# EasyEDA Pro project little_squeaky_machine.eprj, schematic Little Squeaky Machine

## Sheets
1 Processing: Board Name: Little_Squeaky_Machine_Hardware; Create Date: 2025-10-26; Page Name: Processing; Project Name: little_squeaky_machine; Schematic Name: Little Squeaky Machine; Update Date: 2026-02-13; Company: Hi Squeaky Things Lab; Drawn: Daniël; Page Size: A3; Reviewed: Daniël; Version: 0.1.0
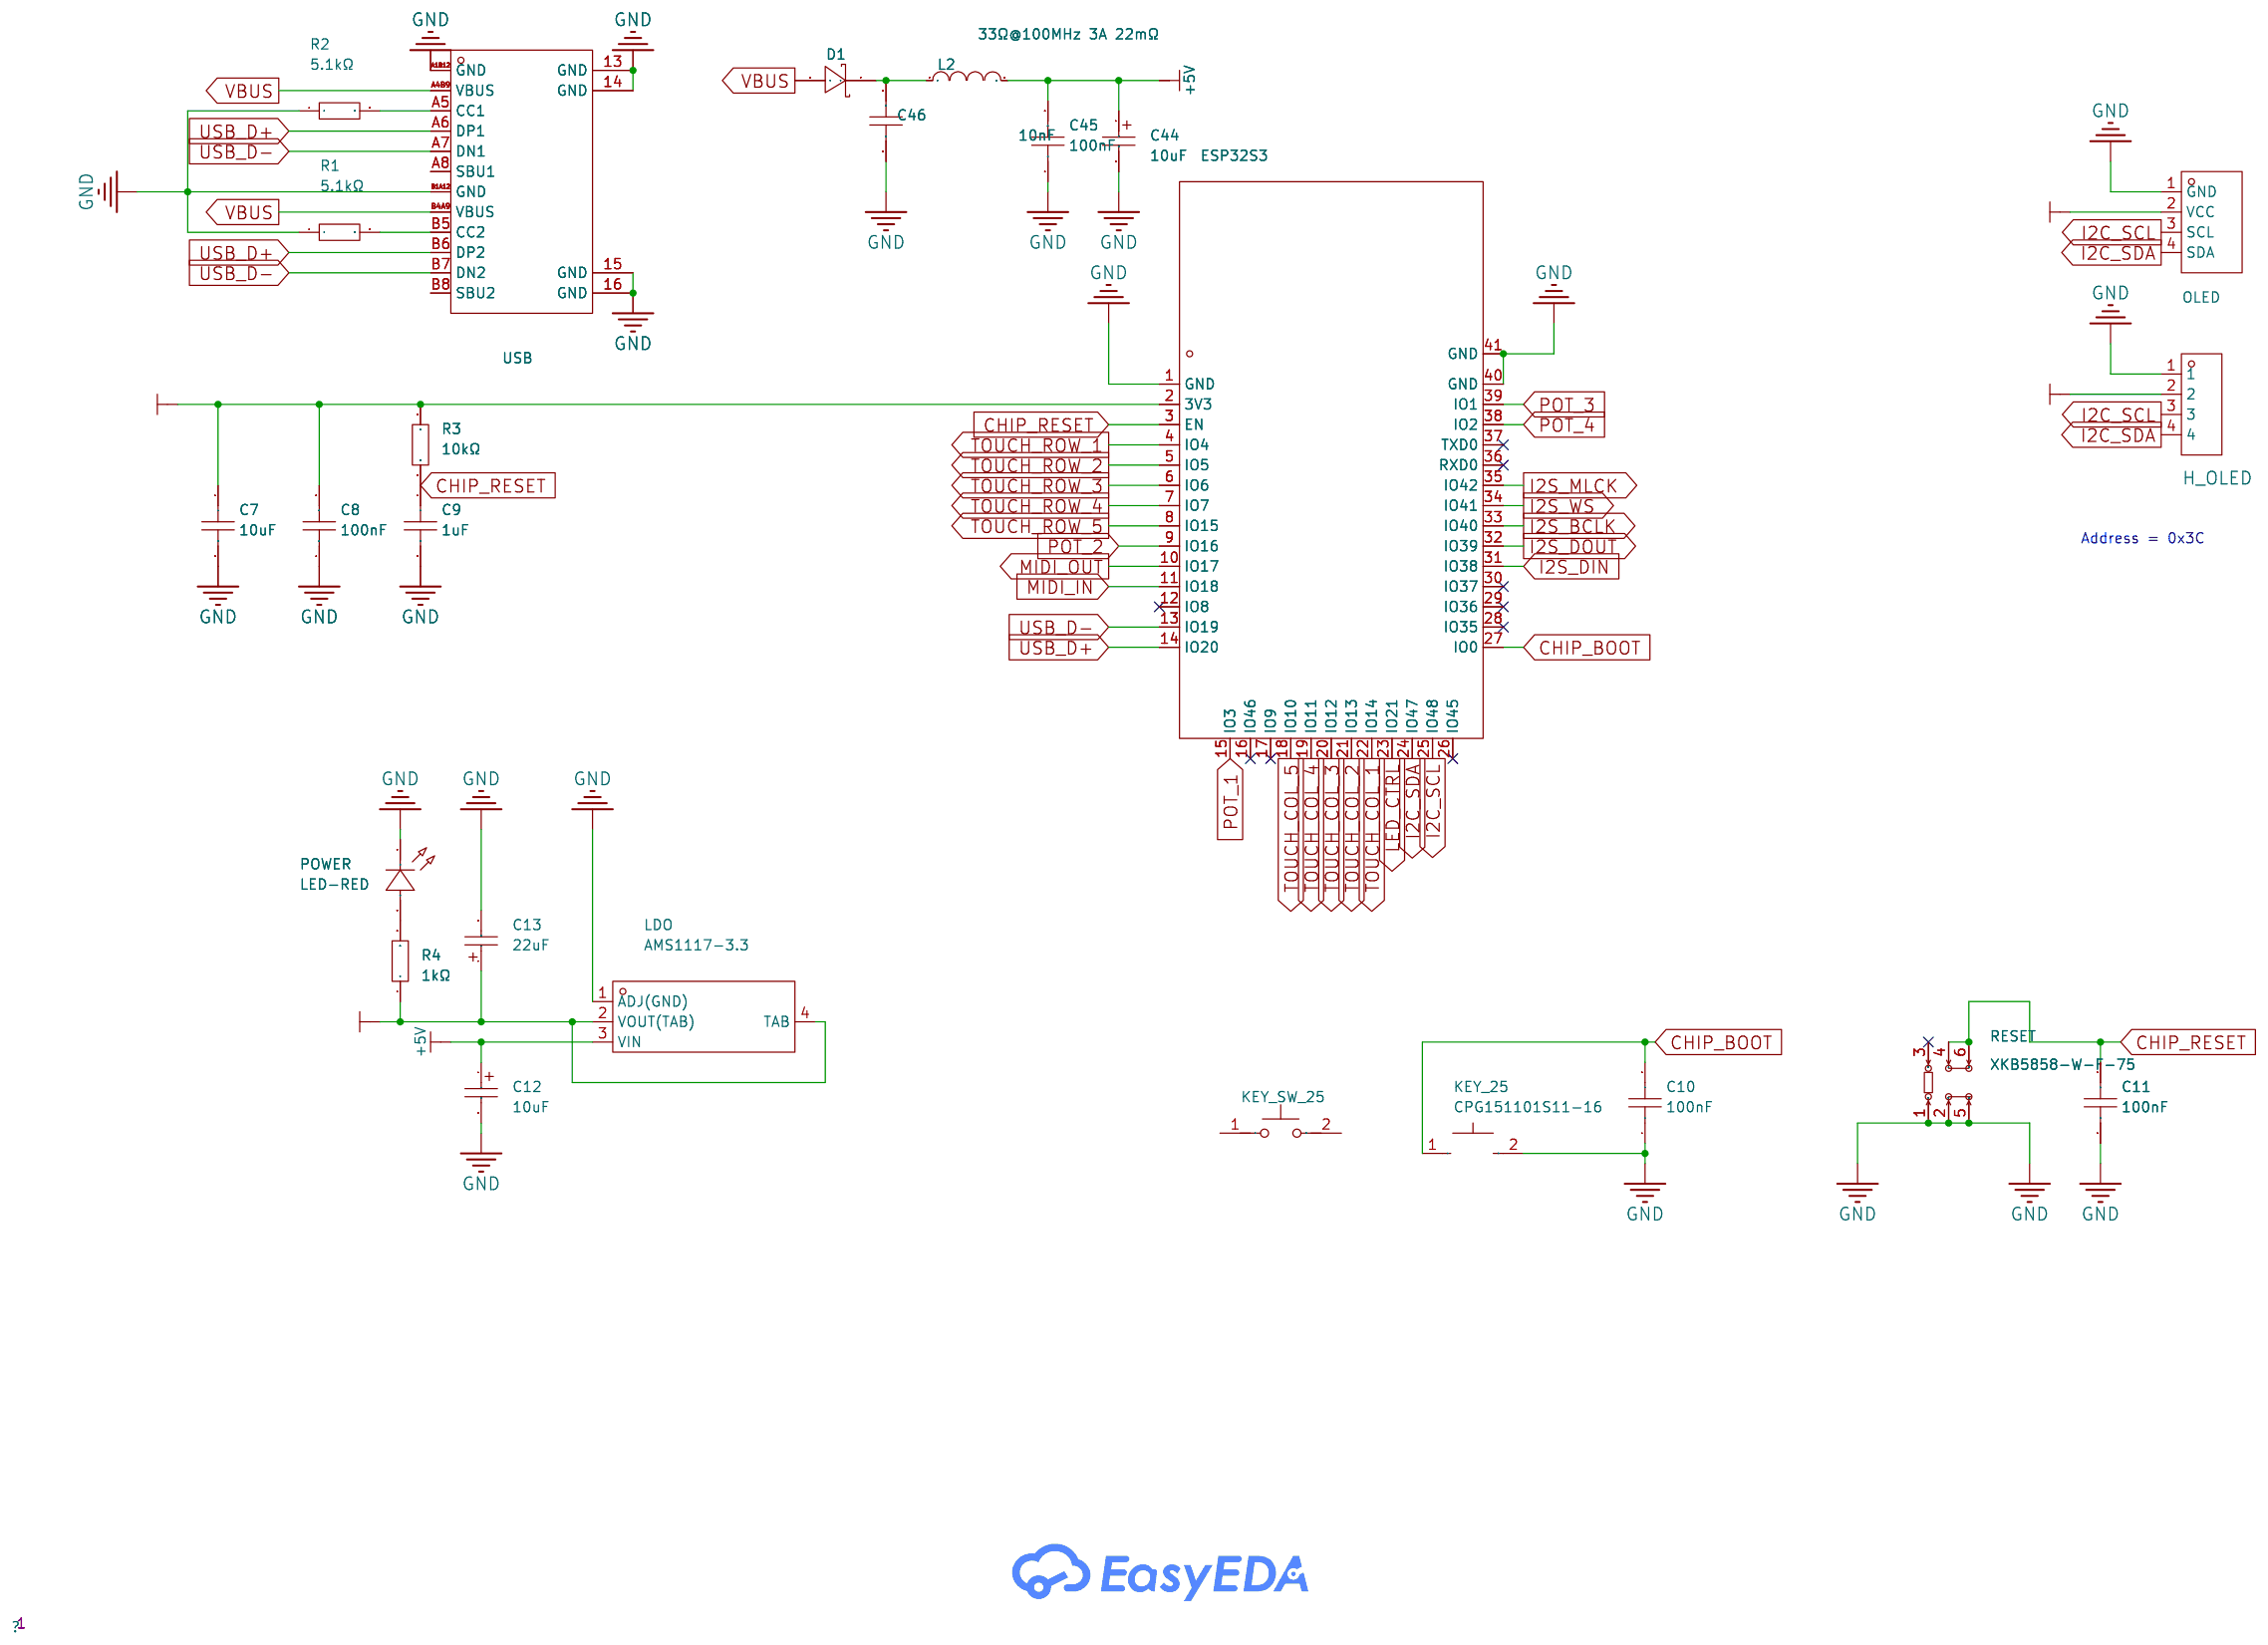
[diagram p0: Processing]
2 Audio Codec: Page Name: Audio Codec; Company: Hi Squeaky Things
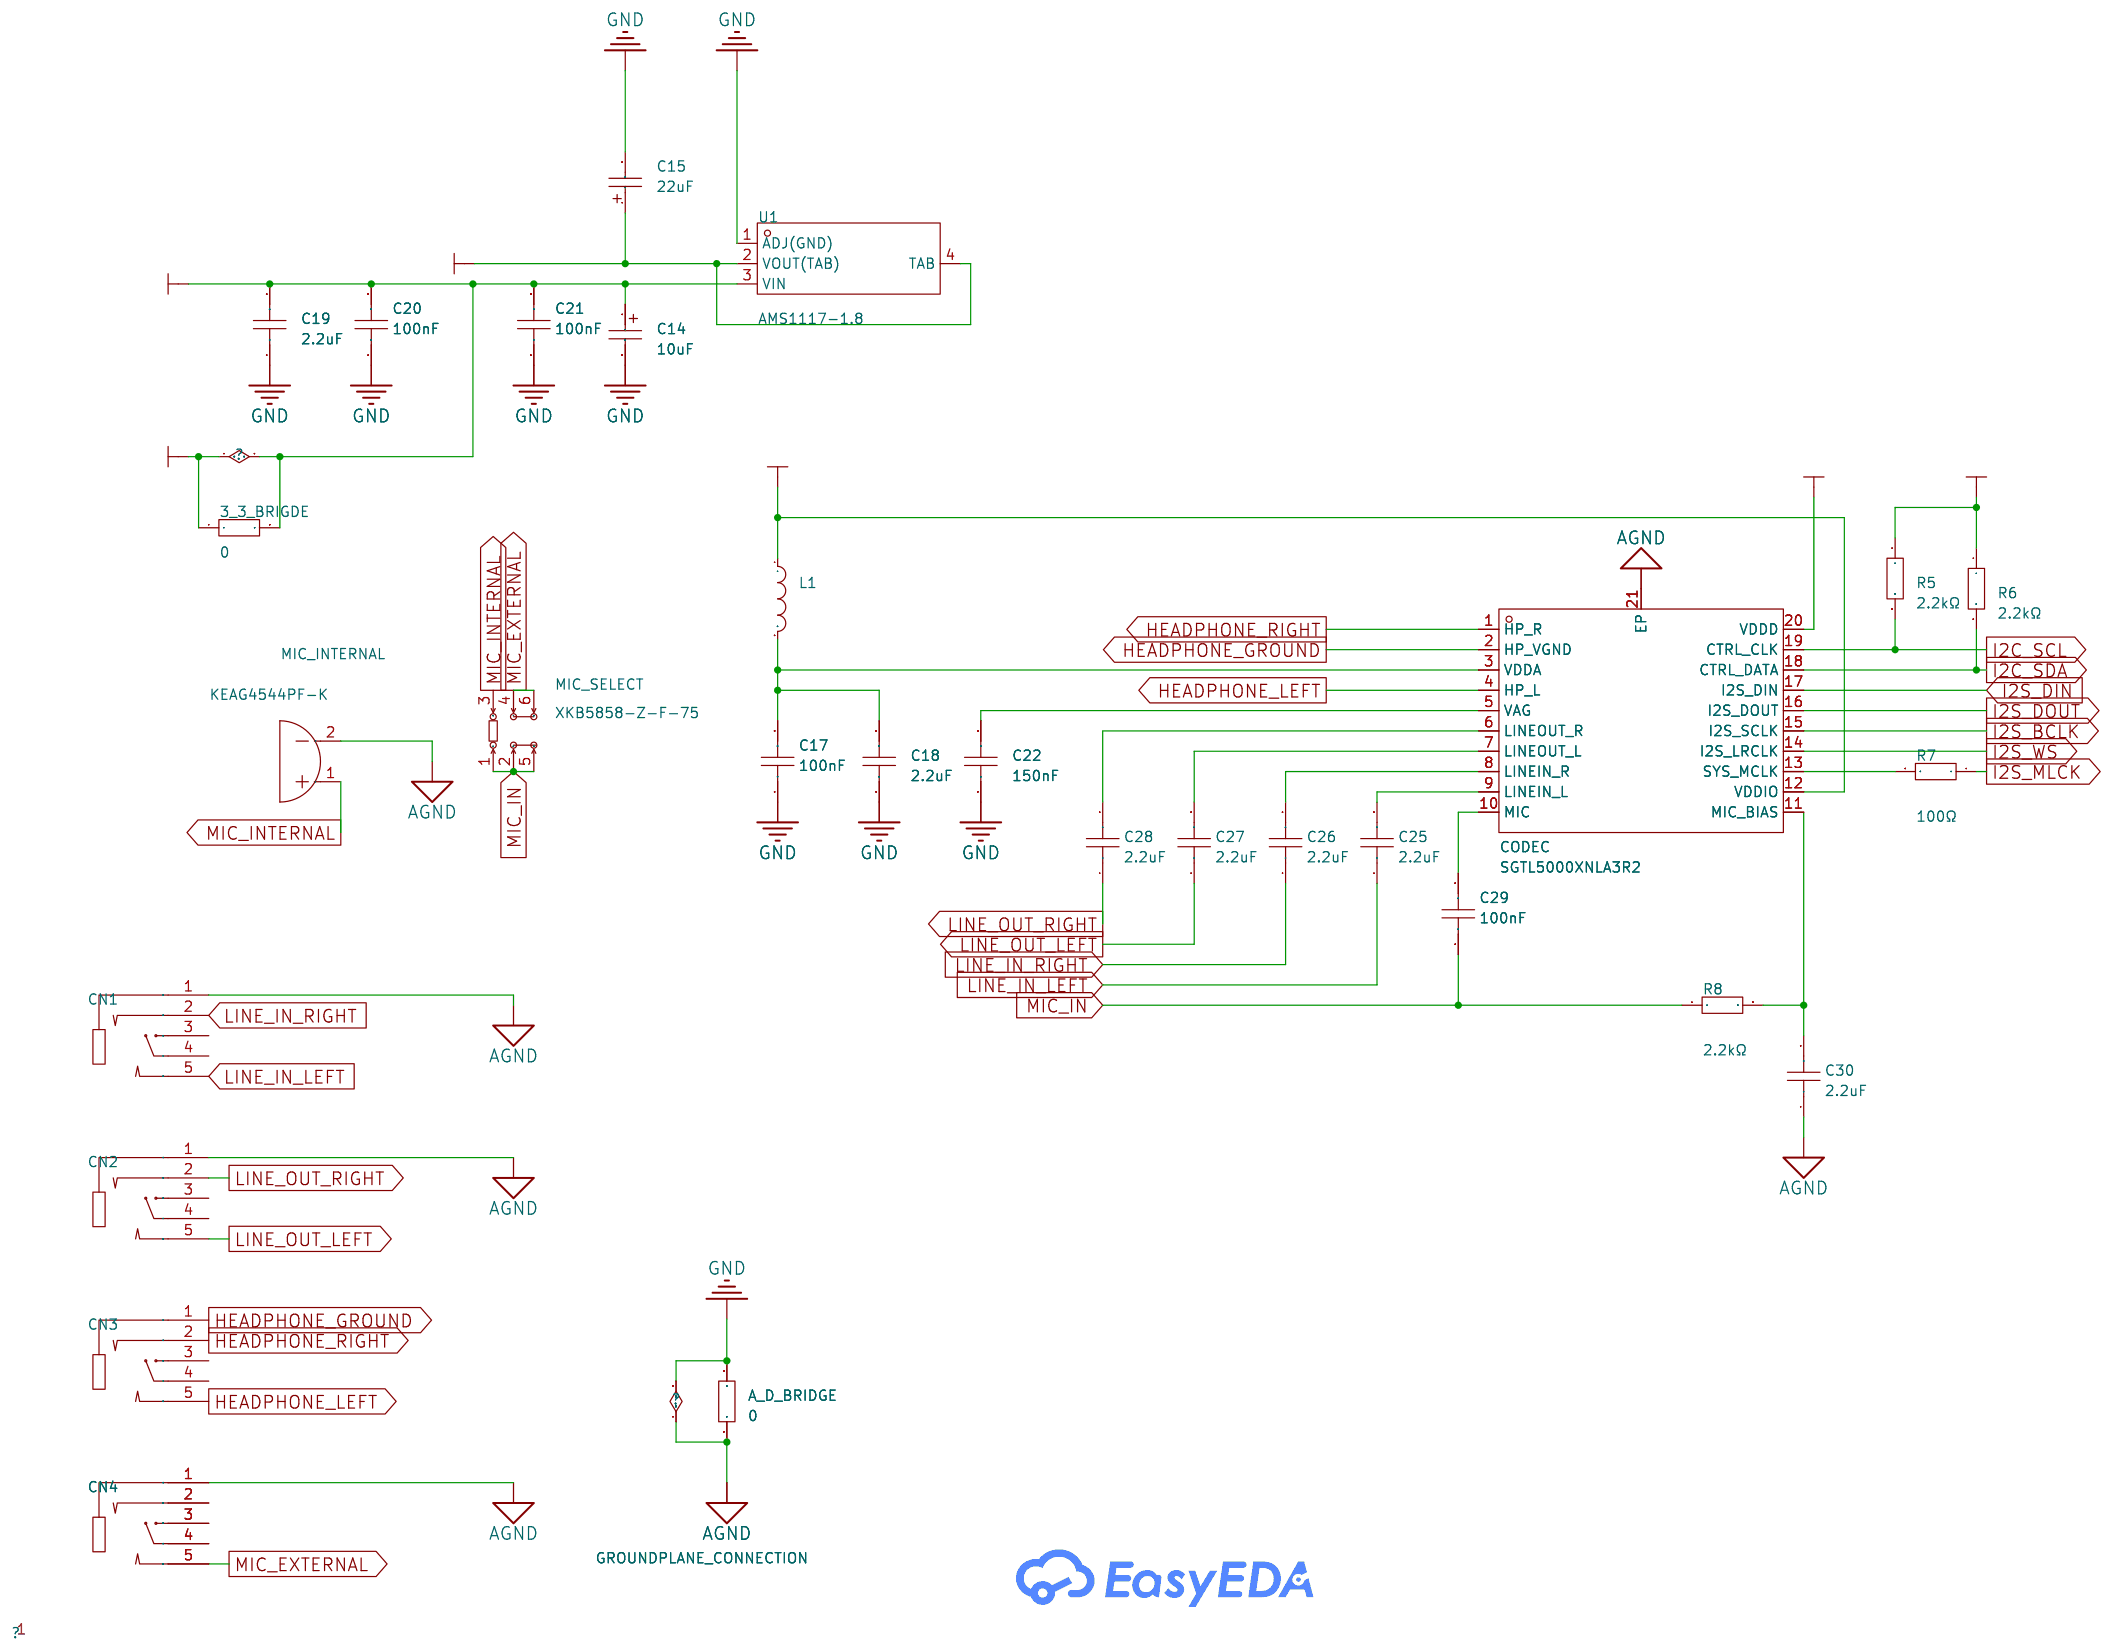
[diagram p1: Audio Codec]
3 Led Controls: Page Name: Led Controls; Company: Hi Squeaky Things; Drawn: Daniel; Page Size: A4
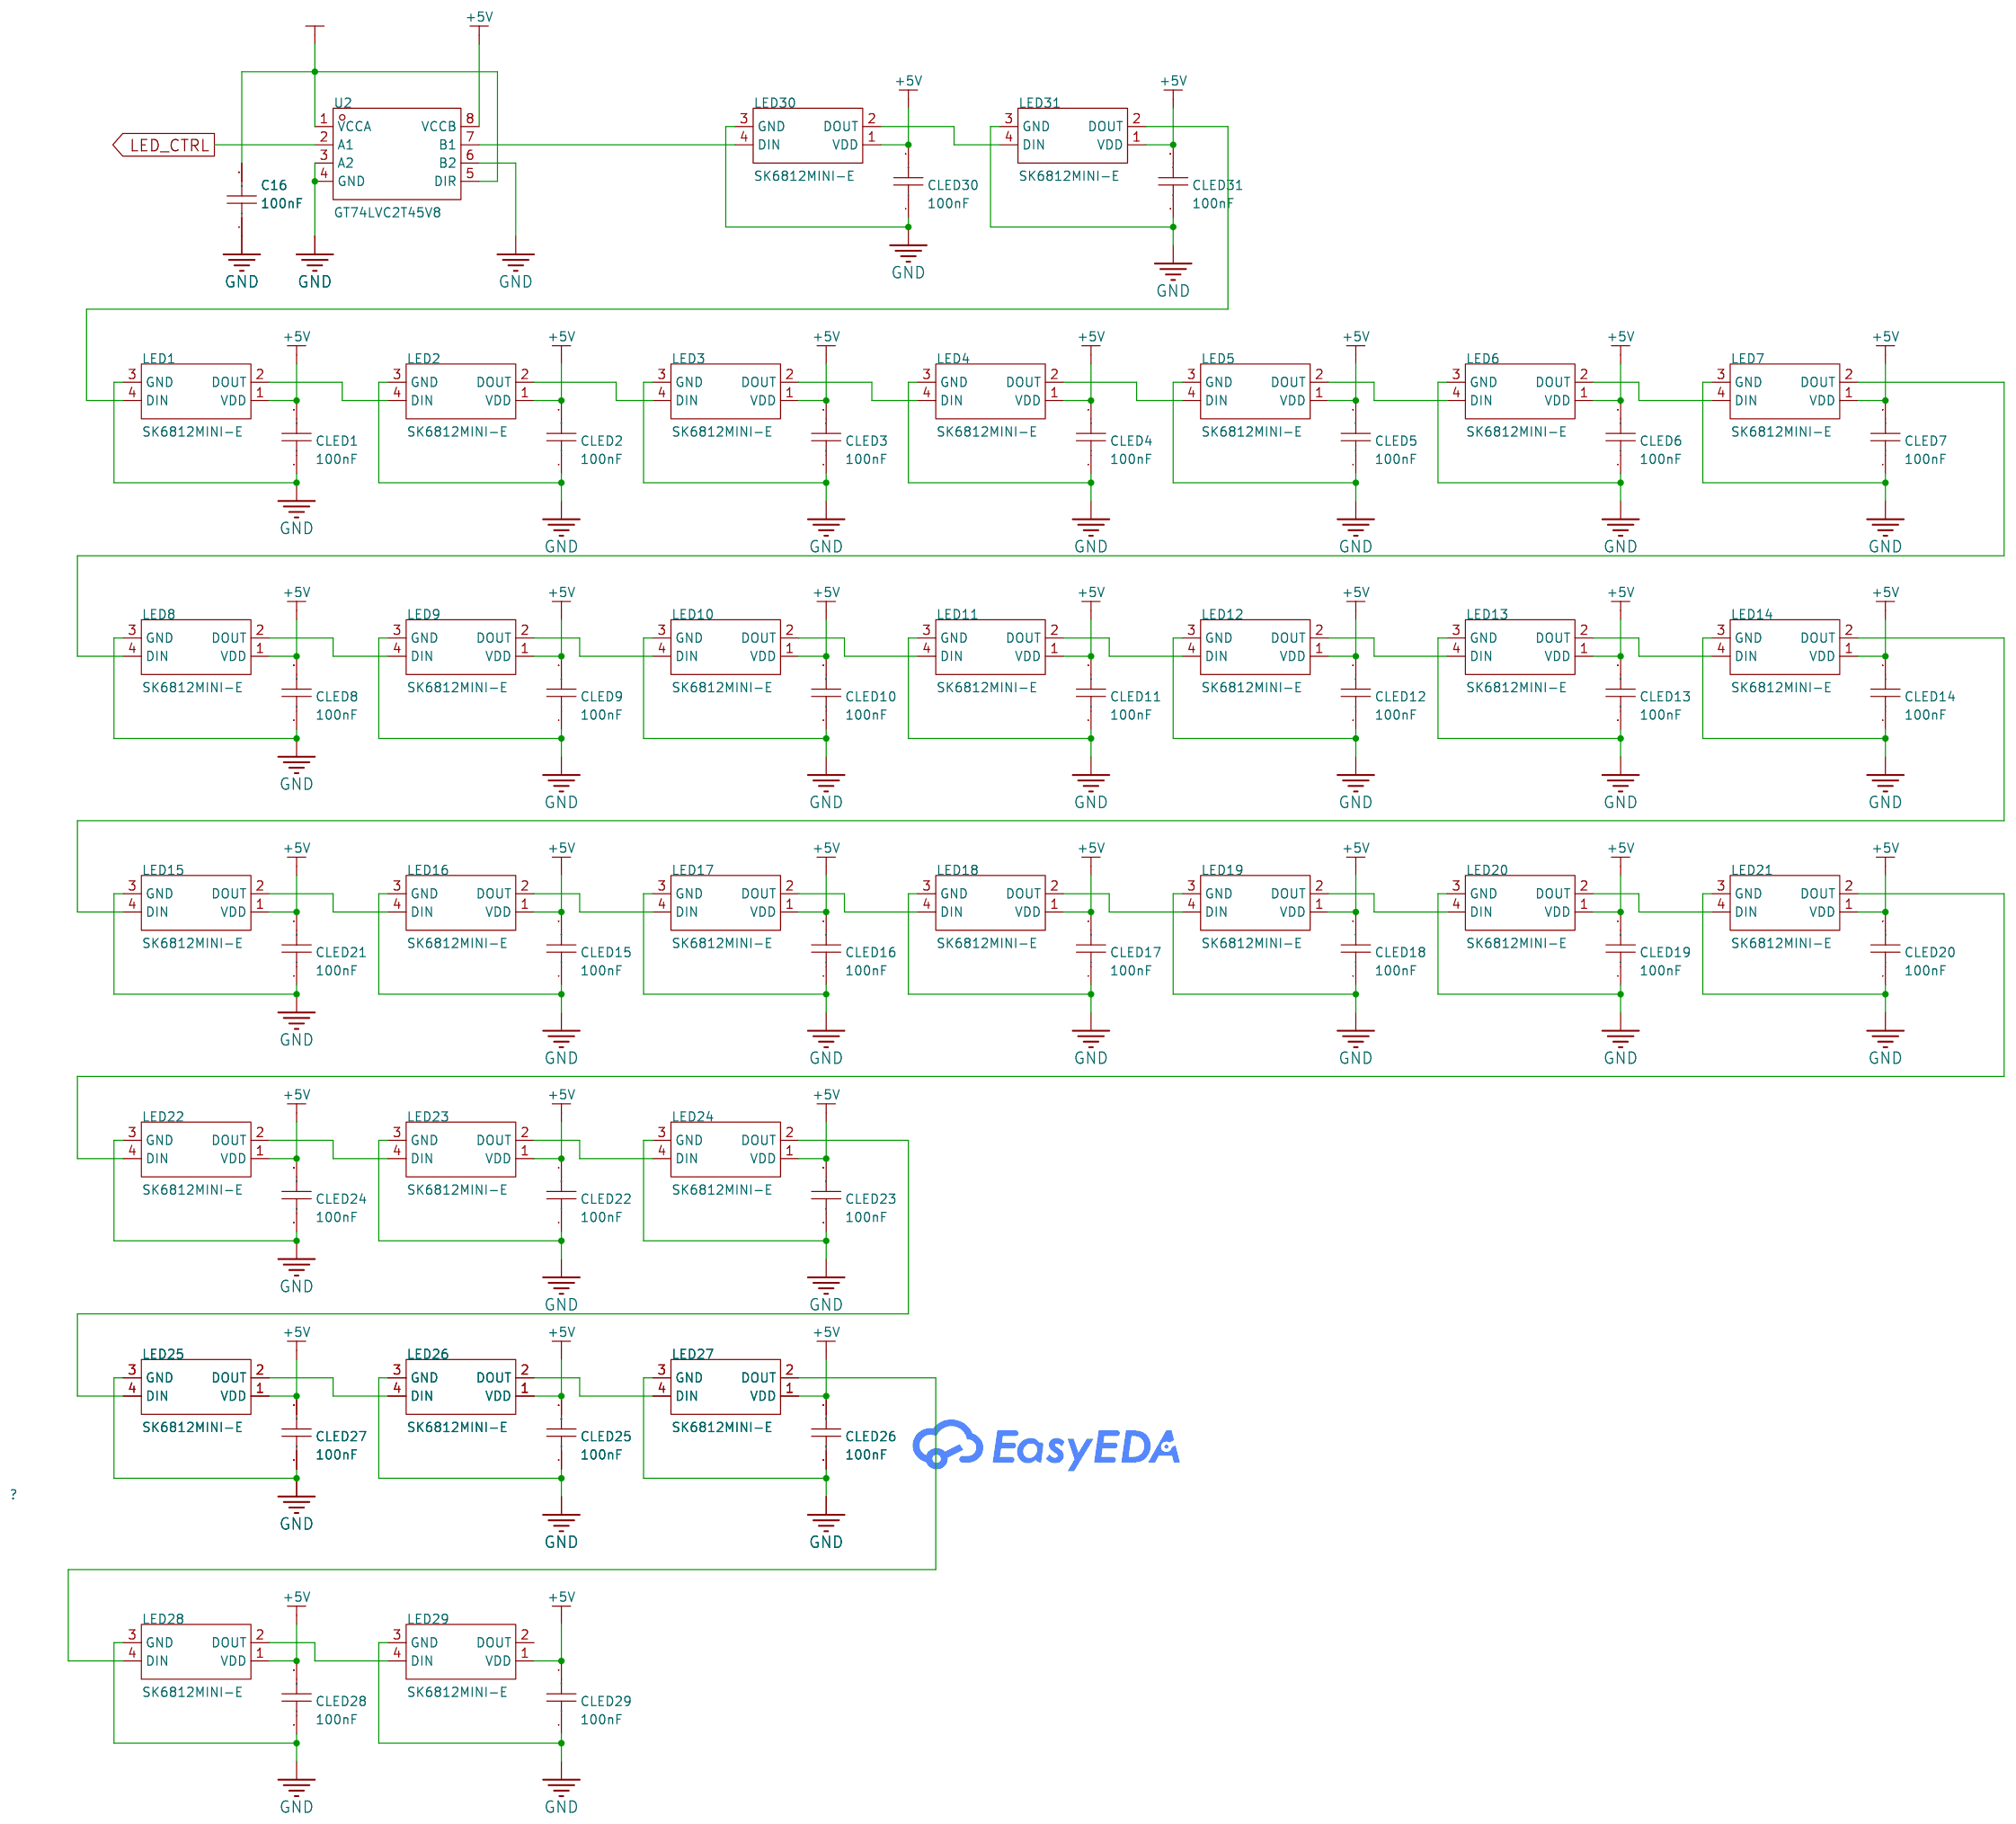
[diagram p2: Led Controls]
4 Key Matrix Controls: Page Name: Key Matrix Controls; Company: Hi Squeaky Things; Page Size: A4
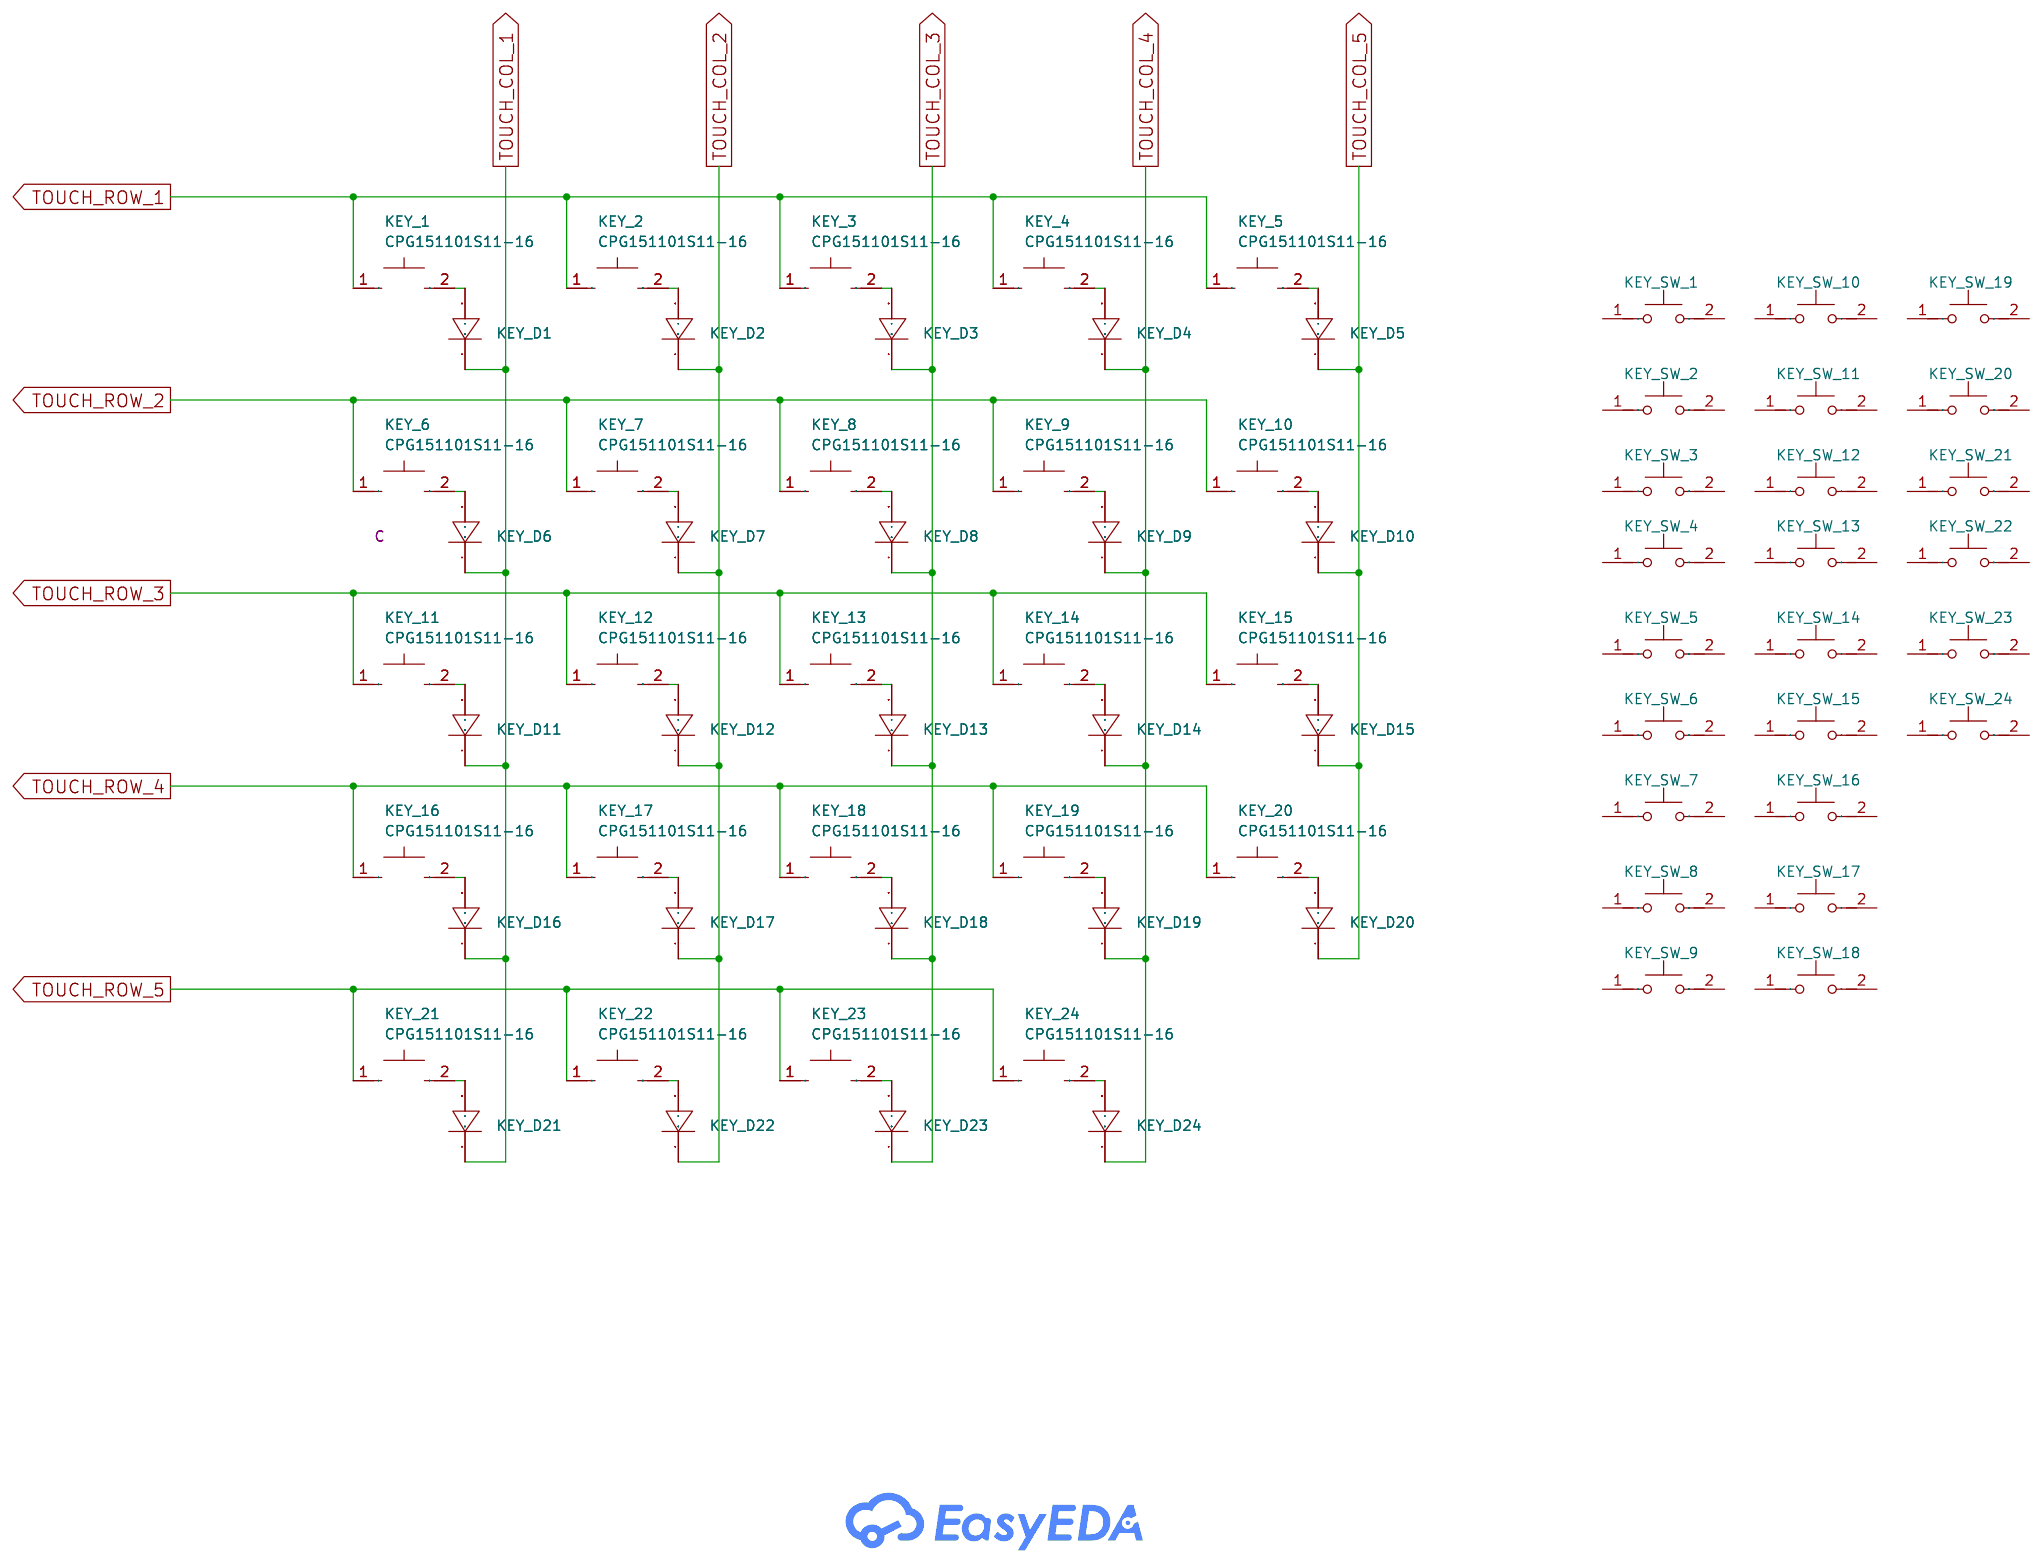
[diagram p3: Key Matrix Controls]
5 Pot and Encoder Controls: Page Name: Pot and Encoder Controls; Company: Hi Squeaky Things; Page Size: A4
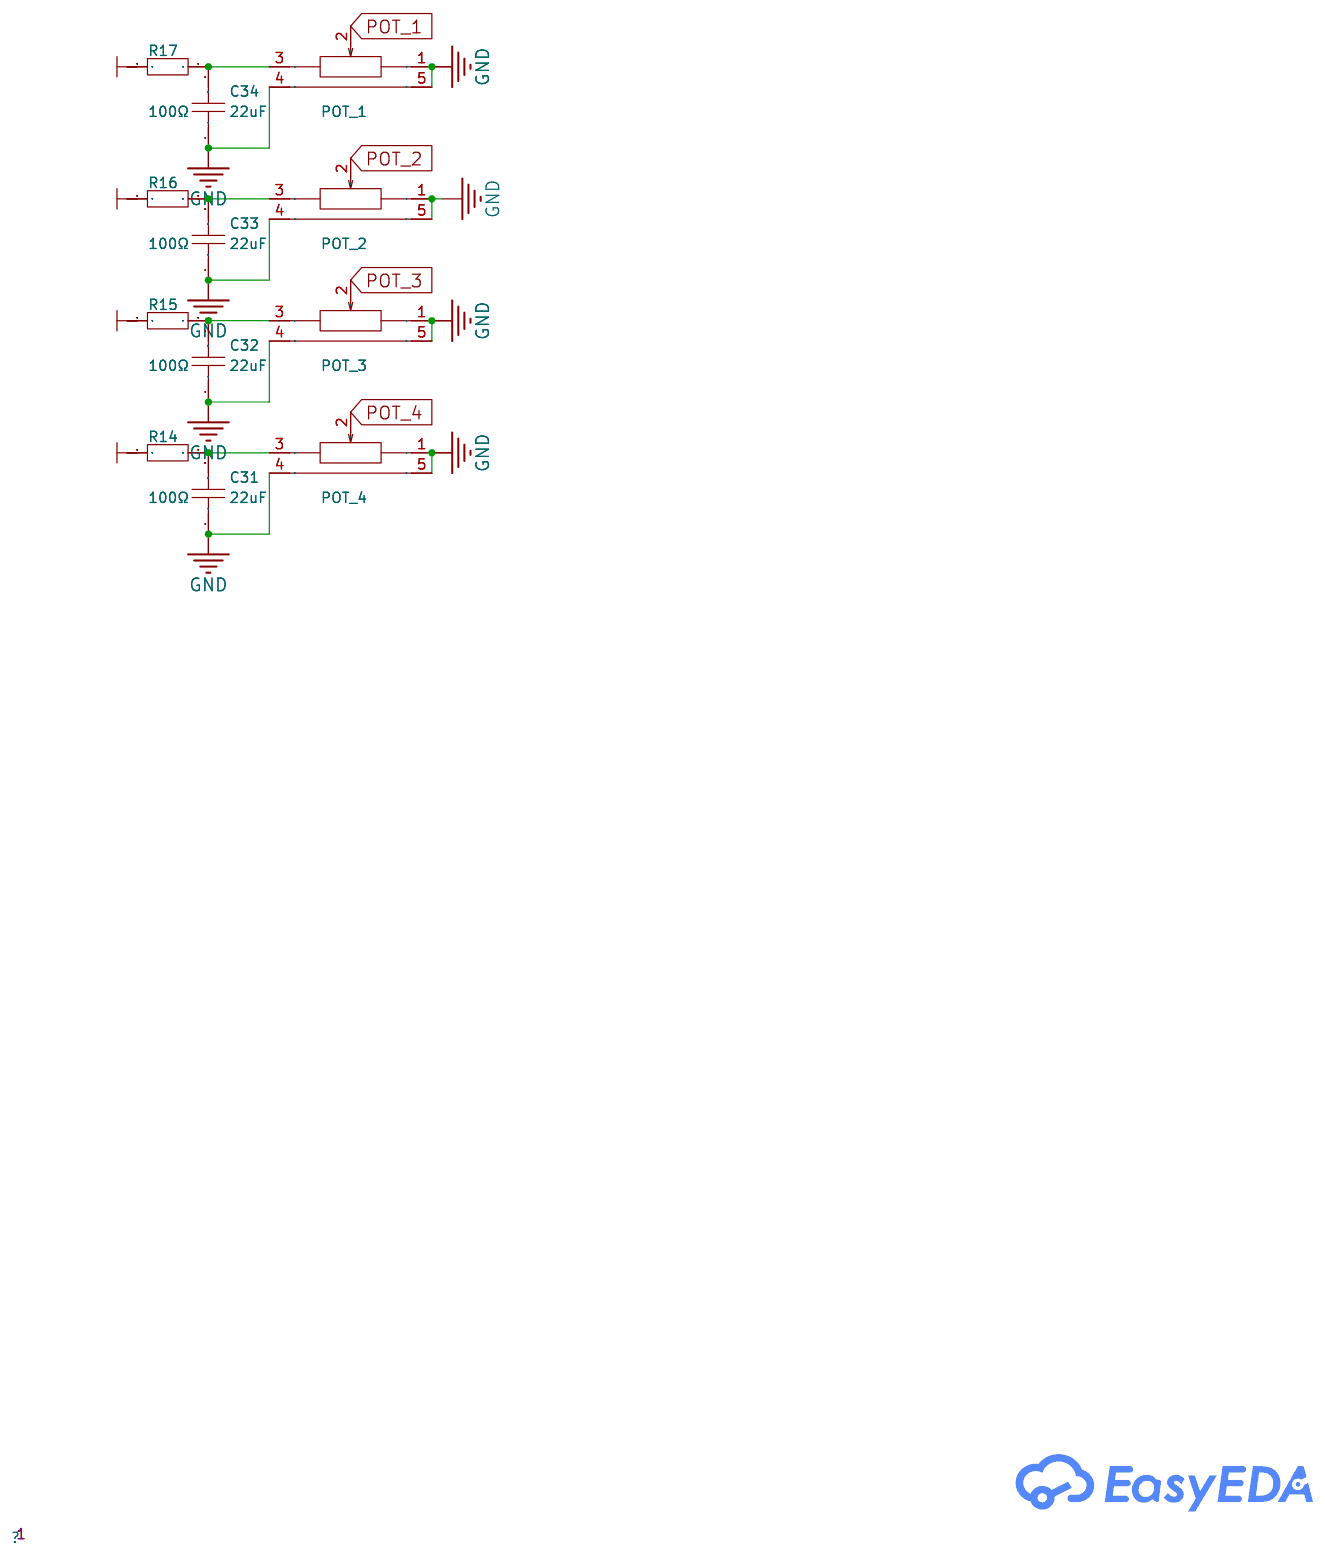
[diagram p4: Pot and Encoder Controls]
6 Midi In/Out: Page Name: Midi In/Out; Company: Hi Squeaky Things; Page Size: A4
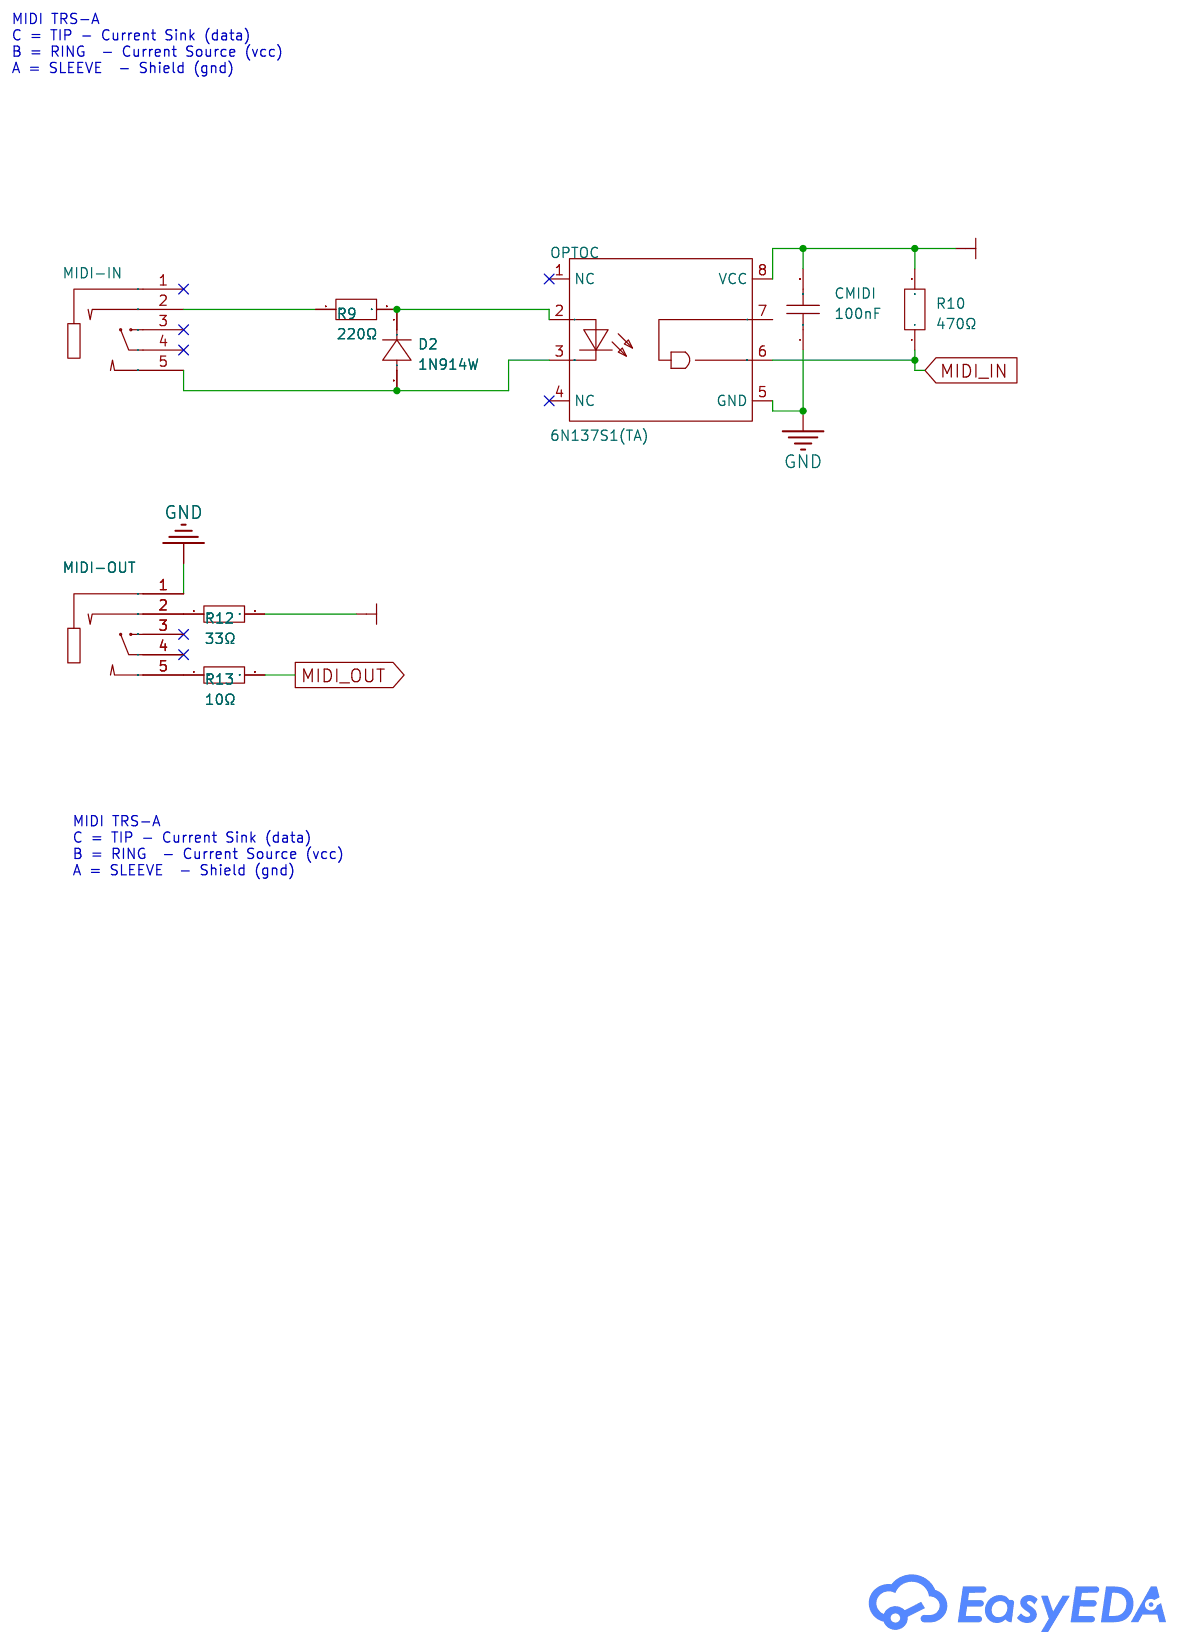
[diagram p5: Midi In/Out]
7 Touch control: Create Date: 2026-02-10; Page Name: Touch control; Company: EasyEDA.com; Page Size: A4; Version: V1.0
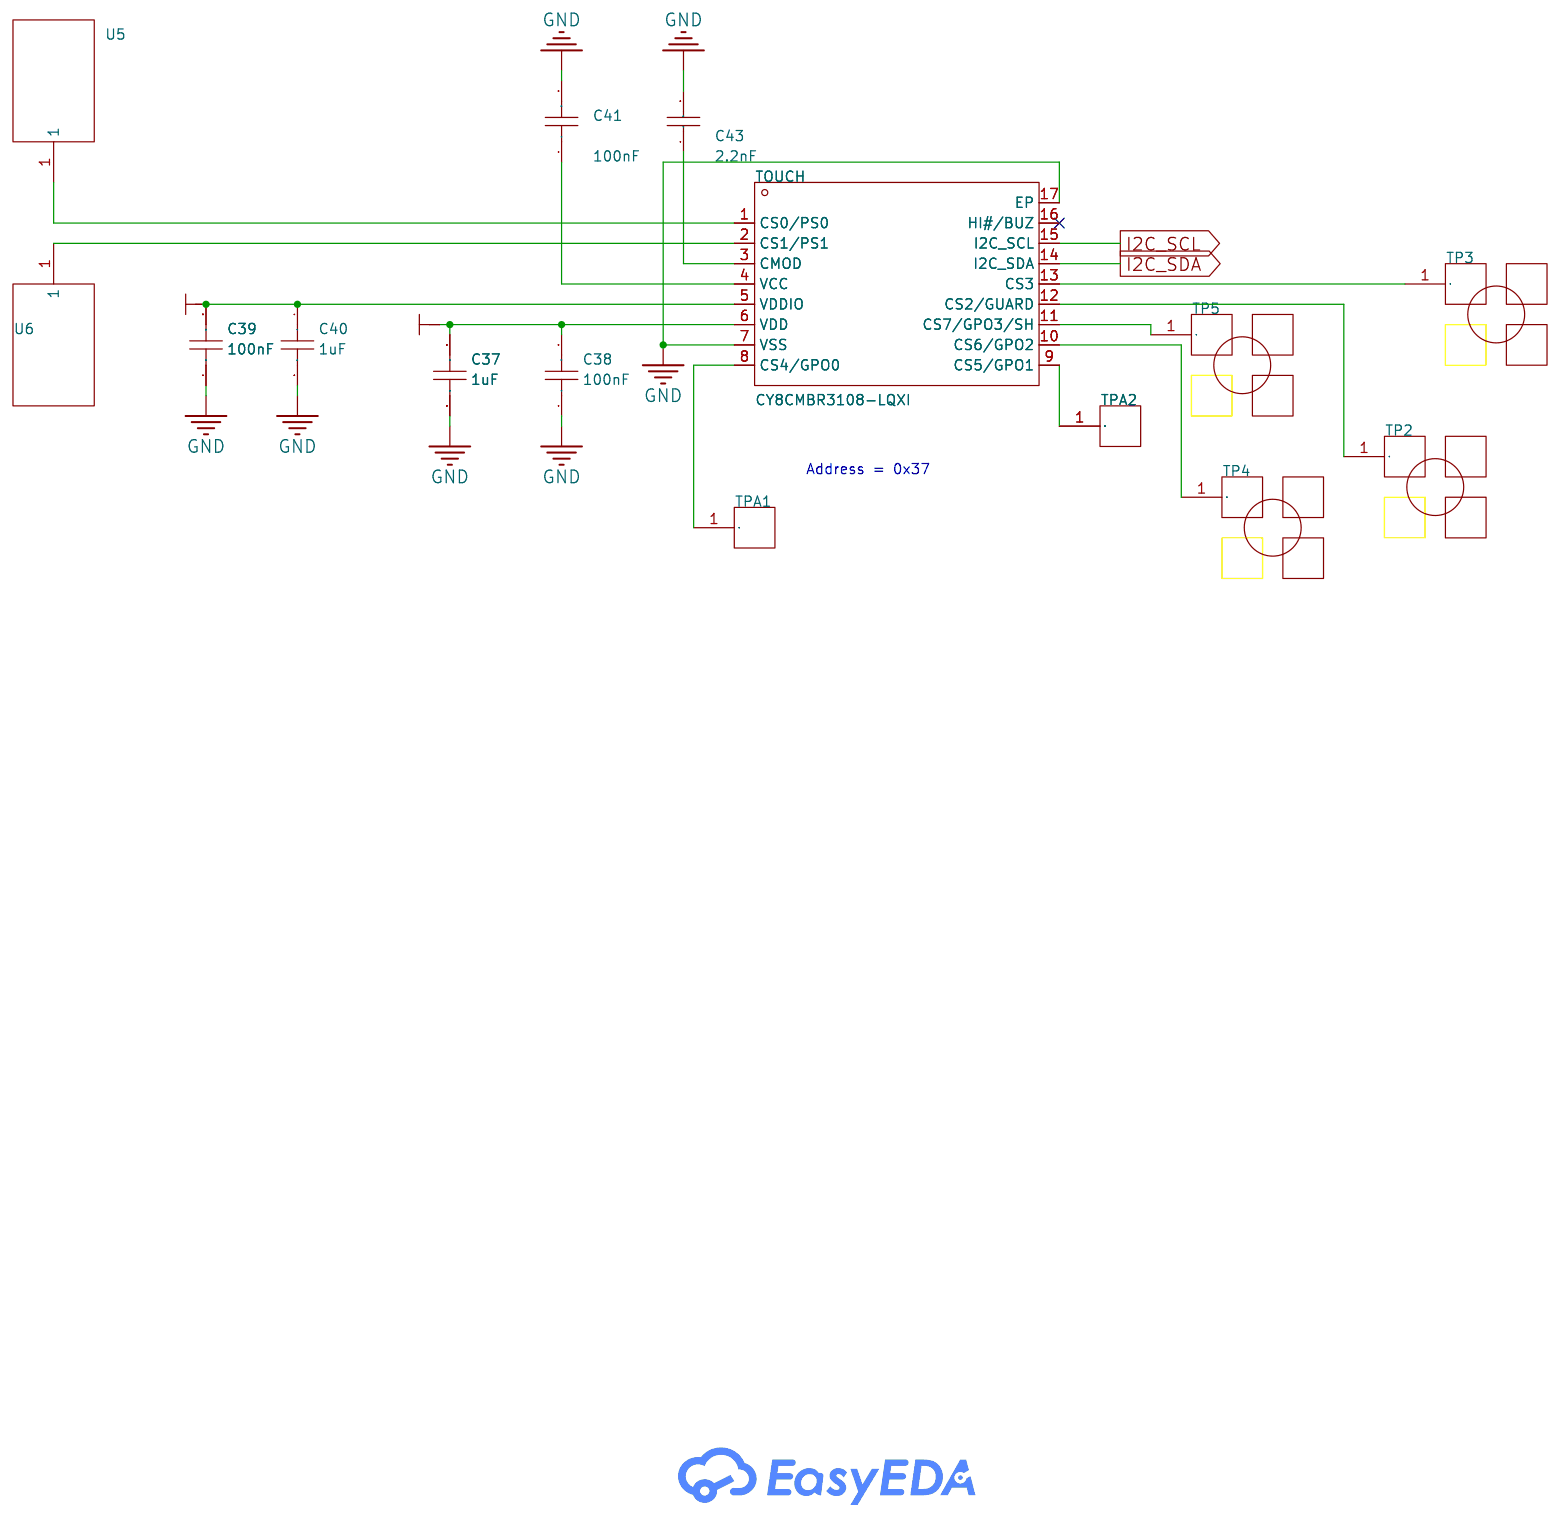
[diagram p6: Touch control]
8 Gyro Control: Create Date: 2026-02-10; Page Name: Gyro Control; Company: EasyEDA.com; Page Size: A4; Version: V1.0
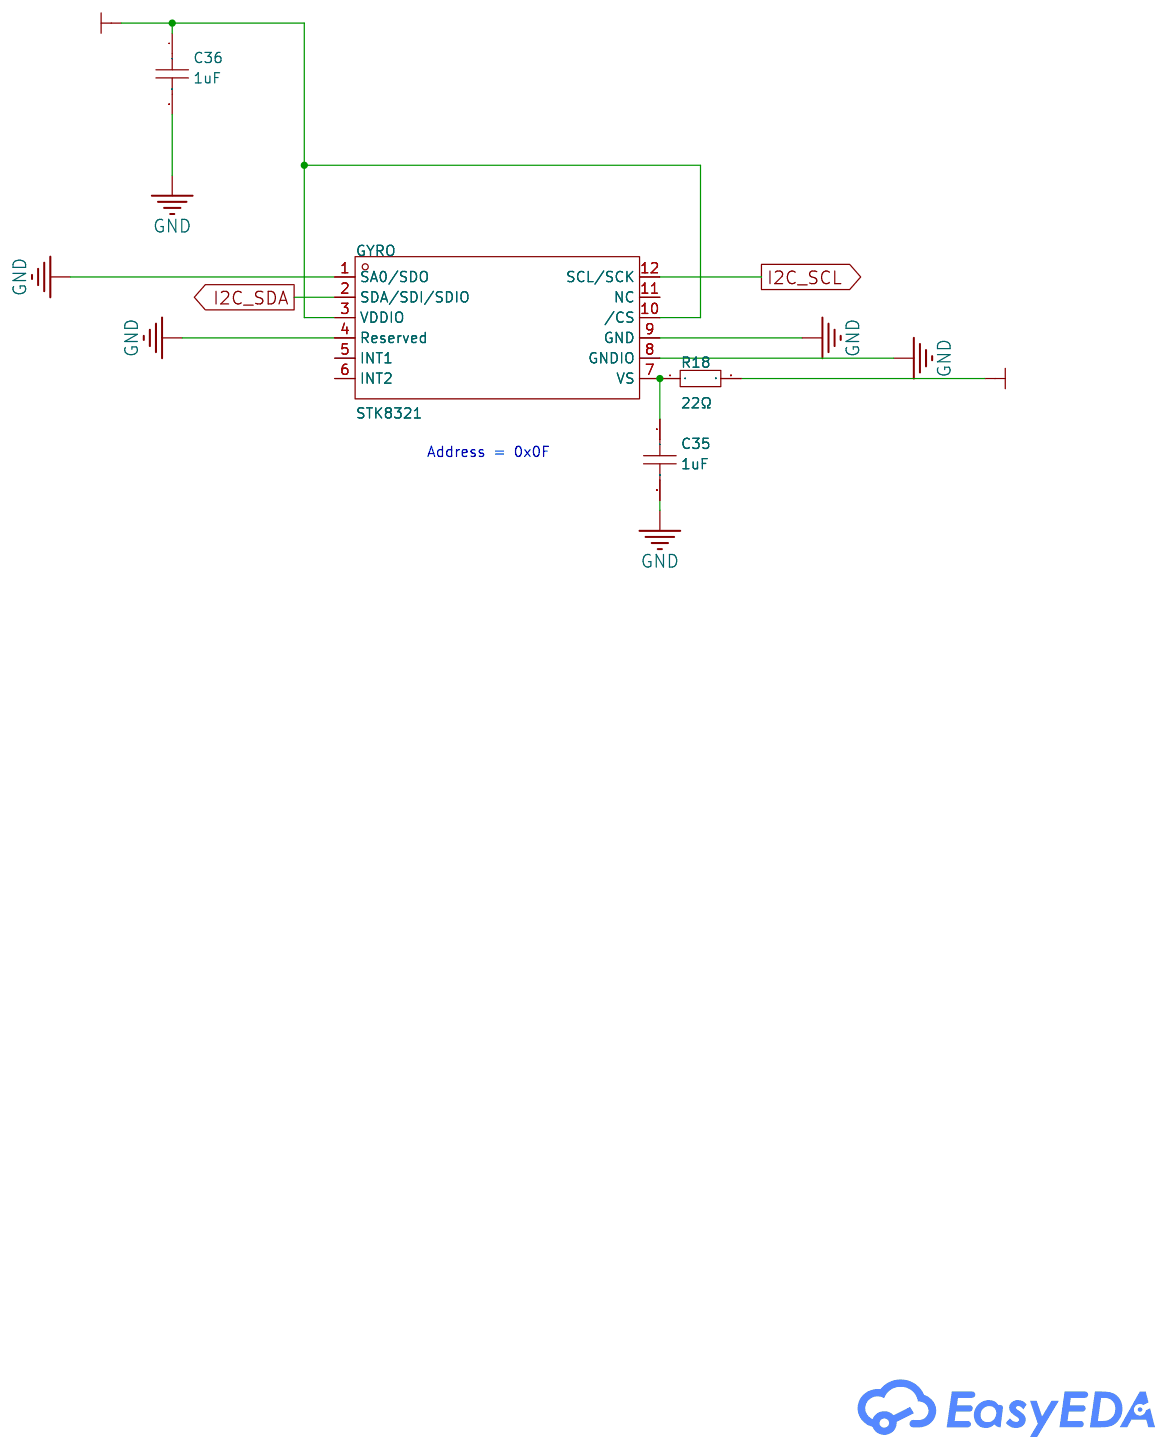
[diagram p7: Gyro Control]

## Parts
sheet Audio Codec
3_3_BRIGDE  0  [R0603]  (no BOM)
A_D_BRIDGE  0  [R0603]  (no BOM)
C14  10uF  [CASE-A_3216]
C15  22uF  [CASE-A_3216]
C17  100nF  [C0402]
C18  2.2uF  [C0402]
C19  2.2uF  [C0402]
C20  100nF  [C0402]
C21  100nF  [C0402]
C22  150nF  [C0402]
C25  2.2uF  [C0402]
C26  2.2uF  [C0402]
C27  2.2uF  [C0402]
C28  2.2uF  [C0402]
C29  100nF  [C0402]
C30  2.2uF  [C0402]
CN1  PJ-3062-HD-B  [AUDIO-TH_PJ-3062-HD-B]
CN2  PJ-3062-HD-B  [AUDIO-TH_PJ-3062-HD-B]
CN3  PJ-3062-HD-B  [AUDIO-TH_PJ-3062-HD-B]
CN4  PJ-3062-HD-B  [AUDIO-TH_PJ-3062-HD-B]
CODEC  SGTL5000XNLA3R2  [QFN-20_L3.0-W3.0-P0.40-BL-EP1.7]
L1  HCB2012KV-601T20  [L0805]
MIC_INTERNAL  KEAG4544PF-K  [MIC-TH_BD9.7-P2.50-D0.8-L-FD]
MIC_SELECT  XKB5858-Z-F-75  [SW-SMD_XKB5858-Z-F-75]
R5  2.2kΩ  [R0603]
R6  2.2kΩ  [R0603]
R7  100Ω  [R0603]
R8  2.2kΩ  [R0603]
U1  AMS1117-1.8  [SOT-223_L6.7-W3.5-P2.30-BR]
sheet Gyro Control
C35  1uF  [C0201]
C36  1uF  [C0201]
GYRO  STK8321  [LGA-12_L2.0-W2.0-P0.50-TR]
R18  22Ω  [R0603]
sheet Key Matrix Controls
KEY_1  CPG151101S11-16  [SMD_KEYBOARD-SW]
KEY_2  CPG151101S11-16  [SMD_KEYBOARD-SW]
KEY_3  CPG151101S11-16  [SMD_KEYBOARD-SW]
KEY_4  CPG151101S11-16  [SMD_KEYBOARD-SW]
KEY_5  CPG151101S11-16  [SMD_KEYBOARD-SW]
KEY_6  CPG151101S11-16  [SMD_KEYBOARD-SW]
KEY_7  CPG151101S11-16  [SMD_KEYBOARD-SW]
KEY_8  CPG151101S11-16  [SMD_KEYBOARD-SW]
KEY_9  CPG151101S11-16  [SMD_KEYBOARD-SW]
KEY_10  CPG151101S11-16  [SMD_KEYBOARD-SW]
KEY_11  CPG151101S11-16  [SMD_KEYBOARD-SW]
KEY_12  CPG151101S11-16  [SMD_KEYBOARD-SW]
KEY_13  CPG151101S11-16  [SMD_KEYBOARD-SW]
KEY_14  CPG151101S11-16  [SMD_KEYBOARD-SW]
KEY_15  CPG151101S11-16  [SMD_KEYBOARD-SW]
KEY_16  CPG151101S11-16  [SMD_KEYBOARD-SW]
KEY_17  CPG151101S11-16  [SMD_KEYBOARD-SW]
KEY_18  CPG151101S11-16  [SMD_KEYBOARD-SW]
KEY_19  CPG151101S11-16  [SMD_KEYBOARD-SW]
KEY_20  CPG151101S11-16  [SMD_KEYBOARD-SW]
KEY_21  CPG151101S11-16  [SMD_KEYBOARD-SW]
KEY_22  CPG151101S11-16  [SMD_KEYBOARD-SW]
KEY_23  CPG151101S11-16  [SMD_KEYBOARD-SW]
KEY_24  CPG151101S11-16  [SMD_KEYBOARD-SW]
KEY_D1  -  [SOD-323_L1.8-W1.3-LS2.5-RD]
KEY_D2  -  [SOD-323_L1.8-W1.3-LS2.5-RD]
KEY_D3  -  [SOD-323_L1.8-W1.3-LS2.5-RD]
KEY_D4  -  [SOD-323_L1.8-W1.3-LS2.5-RD]
KEY_D5  -  [SOD-323_L1.8-W1.3-LS2.5-RD]
KEY_D6  -  [SOD-323_L1.8-W1.3-LS2.5-RD]
KEY_D7  -  [SOD-323_L1.8-W1.3-LS2.5-RD]
KEY_D8  -  [SOD-323_L1.8-W1.3-LS2.5-RD]
KEY_D9  -  [SOD-323_L1.8-W1.3-LS2.5-RD]
KEY_D10  -  [SOD-323_L1.8-W1.3-LS2.5-RD]
KEY_D11  -  [SOD-323_L1.8-W1.3-LS2.5-RD]
KEY_D12  -  [SOD-323_L1.8-W1.3-LS2.5-RD]
KEY_D13  -  [SOD-323_L1.8-W1.3-LS2.5-RD]
KEY_D14  -  [SOD-323_L1.8-W1.3-LS2.5-RD]
KEY_D15  -  [SOD-323_L1.8-W1.3-LS2.5-RD]
KEY_D16  -  [SOD-323_L1.8-W1.3-LS2.5-RD]
KEY_D17  -  [SOD-323_L1.8-W1.3-LS2.5-RD]
KEY_D18  -  [SOD-323_L1.8-W1.3-LS2.5-RD]
KEY_D19  -  [SOD-323_L1.8-W1.3-LS2.5-RD]
KEY_D20  -  [SOD-323_L1.8-W1.3-LS2.5-RD]
KEY_D21  -  [SOD-323_L1.8-W1.3-LS2.5-RD]
KEY_D22  -  [SOD-323_L1.8-W1.3-LS2.5-RD]
KEY_D23  -  [SOD-323_L1.8-W1.3-LS2.5-RD]
KEY_D24  -  [SOD-323_L1.8-W1.3-LS2.5-RD]
KEY_SW_1  CPG1511F01S04  [KEY-TH_CPG1511F01S0X]  (no BOM)
KEY_SW_2  CPG1511F01S04  [KEY-TH_CPG1511F01S0X]  (no BOM)
KEY_SW_3  CPG1511F01S04  [KEY-TH_CPG1511F01S0X]  (no BOM)
KEY_SW_4  CPG1511F01S04  [KEY-TH_CPG1511F01S0X]  (no BOM)
KEY_SW_5  CPG1511F01S04  [KEY-TH_CPG1511F01S0X]  (no BOM)
KEY_SW_6  CPG1511F01S04  [KEY-TH_CPG1511F01S0X]  (no BOM)
KEY_SW_7  CPG1511F01S04  [KEY-TH_CPG1511F01S0X]  (no BOM)
KEY_SW_8  CPG1511F01S04  [KEY-TH_CPG1511F01S0X]  (no BOM)
KEY_SW_9  CPG1511F01S04  [KEY-TH_CPG1511F01S0X]  (no BOM)
KEY_SW_10  CPG1511F01S04  [KEY-TH_CPG1511F01S0X]  (no BOM)
KEY_SW_11  CPG1511F01S04  [KEY-TH_CPG1511F01S0X]  (no BOM)
KEY_SW_12  CPG1511F01S04  [KEY-TH_CPG1511F01S0X]  (no BOM)
KEY_SW_13  CPG1511F01S04  [KEY-TH_CPG1511F01S0X]  (no BOM)
KEY_SW_14  CPG1511F01S04  [KEY-TH_CPG1511F01S0X]  (no BOM)
KEY_SW_15  CPG1511F01S04  [KEY-TH_CPG1511F01S0X]  (no BOM)
KEY_SW_16  CPG1511F01S04  [KEY-TH_CPG1511F01S0X]  (no BOM)
KEY_SW_17  CPG1511F01S04  [KEY-TH_CPG1511F01S0X]  (no BOM)
KEY_SW_18  CPG1511F01S04  [KEY-TH_CPG1511F01S0X]  (no BOM)
KEY_SW_19  CPG1511F01S04  [KEY-TH_CPG1511F01S0X]  (no BOM)
KEY_SW_20  CPG1511F01S04  [KEY-TH_CPG1511F01S0X]  (no BOM)
KEY_SW_21  CPG1511F01S04  [KEY-TH_CPG1511F01S0X]  (no BOM)
KEY_SW_22  CPG1511F01S04  [KEY-TH_CPG1511F01S0X]  (no BOM)
KEY_SW_23  CPG1511F01S04  [KEY-TH_CPG1511F01S0X]  (no BOM)
KEY_SW_24  CPG1511F01S04  [KEY-TH_CPG1511F01S0X]  (no BOM)
sheet Led Controls
C16  100nF  [C0402]
CLED1  100nF  [C0402]
CLED2  100nF  [C0402]
CLED3  100nF  [C0402]
CLED4  100nF  [C0402]
CLED5  100nF  [C0402]
CLED6  100nF  [C0402]
CLED7  100nF  [C0402]
CLED8  100nF  [C0402]
CLED9  100nF  [C0402]
CLED10  100nF  [C0402]
CLED11  100nF  [C0402]
CLED12  100nF  [C0402]
CLED13  100nF  [C0402]
CLED14  100nF  [C0402]
CLED15  100nF  [C0402]
CLED16  100nF  [C0402]
CLED17  100nF  [C0402]
CLED18  100nF  [C0402]
CLED19  100nF  [C0402]
CLED20  100nF  [C0402]
CLED21  100nF  [C0402]
CLED22  100nF  [C0402]
CLED23  100nF  [C0402]
CLED24  100nF  [C0402]
CLED25  100nF  [C0402]
CLED26  100nF  [C0402]
CLED27  100nF  [C0402]
CLED28  100nF  [C0402]
CLED29  100nF  [C0402]
CLED30  100nF  [C0402]
CLED31  100nF  [C0402]
LED1  SK6812MINI-E  [LED-SMD_L3.2-W2.8-LS5.9_SK6812MINI-E]
LED2  SK6812MINI-E  [LED-SMD_L3.2-W2.8-LS5.9_SK6812MINI-E]
LED3  SK6812MINI-E  [LED-SMD_L3.2-W2.8-LS5.9_SK6812MINI-E]
LED4  SK6812MINI-E  [LED-SMD_L3.2-W2.8-LS5.9_SK6812MINI-E]
LED5  SK6812MINI-E  [LED-SMD_L3.2-W2.8-LS5.9_SK6812MINI-E]
LED6  SK6812MINI-E  [LED-SMD_L3.2-W2.8-LS5.9_SK6812MINI-E]
LED7  SK6812MINI-E  [LED-SMD_L3.2-W2.8-LS5.9_SK6812MINI-E]
LED8  SK6812MINI-E  [LED-SMD_L3.2-W2.8-LS5.9_SK6812MINI-E]
LED9  SK6812MINI-E  [LED-SMD_L3.2-W2.8-LS5.9_SK6812MINI-E]
LED10  SK6812MINI-E  [LED-SMD_L3.2-W2.8-LS5.9_SK6812MINI-E]
LED11  SK6812MINI-E  [LED-SMD_L3.2-W2.8-LS5.9_SK6812MINI-E]
LED12  SK6812MINI-E  [LED-SMD_L3.2-W2.8-LS5.9_SK6812MINI-E]
LED13  SK6812MINI-E  [LED-SMD_L3.2-W2.8-LS5.9_SK6812MINI-E]
LED14  SK6812MINI-E  [LED-SMD_L3.2-W2.8-LS5.9_SK6812MINI-E]
LED15  SK6812MINI-E  [LED-SMD_L3.2-W2.8-LS5.9_SK6812MINI-E]
LED16  SK6812MINI-E  [LED-SMD_L3.2-W2.8-LS5.9_SK6812MINI-E]
LED17  SK6812MINI-E  [LED-SMD_L3.2-W2.8-LS5.9_SK6812MINI-E]
LED18  SK6812MINI-E  [LED-SMD_L3.2-W2.8-LS5.9_SK6812MINI-E]
LED19  SK6812MINI-E  [LED-SMD_L3.2-W2.8-LS5.9_SK6812MINI-E]
LED20  SK6812MINI-E  [LED-SMD_L3.2-W2.8-LS5.9_SK6812MINI-E]
LED21  SK6812MINI-E  [LED-SMD_L3.2-W2.8-LS5.9_SK6812MINI-E]
LED22  SK6812MINI-E  [LED-SMD_L3.2-W2.8-LS5.9_SK6812MINI-E]
LED23  SK6812MINI-E  [LED-SMD_L3.2-W2.8-LS5.9_SK6812MINI-E]
LED24  SK6812MINI-E  [LED-SMD_L3.2-W2.8-LS5.9_SK6812MINI-E]
LED25  SK6812MINI-E  [LED-SMD_L3.2-W2.8-LS5.9_SK6812MINI-E]
LED26  SK6812MINI-E  [LED-SMD_L3.2-W2.8-LS5.9_SK6812MINI-E]
LED27  SK6812MINI-E  [LED-SMD_L3.2-W2.8-LS5.9_SK6812MINI-E]
LED28  SK6812MINI-E  [LED-SMD_L3.2-W2.8-LS5.9_SK6812MINI-E]
LED29  SK6812MINI-E  [LED-SMD_L3.2-W2.8-LS5.9_SK6812MINI-E]
LED30  SK6812MINI-E  [LED-SMD_L3.2-W2.8-LS5.9_SK6812MINI-E]
LED31  SK6812MINI-E  [LED-SMD_L3.2-W2.8-LS5.9_SK6812MINI-E]
U2  GT74LVC2T45V8  [VSSOP-8_L2.3-W2.0-P0.50-LS3.1-BL]
sheet Midi In/Out
CMIDI  100nF  [C0402]
D2  1N914W  [SOD-123_L2.7-W1.6-LS3.7-RD-1]
MIDI-IN  PJ-3062-HD-B  [AUDIO-TH_PJ-3062-HD-B]
MIDI-OUT  PJ-3062-HD-B  [AUDIO-TH_PJ-3062-HD-B]
OPTOC  6N137S1(TA)  [SMD-8_L9.8-W6.6-P2.54-LS10.3-BL]
R9  220Ω  [R0603]
R10  470Ω  [R0603]
R12  33Ω  [R0603]
R13  10Ω  [R0603]
sheet Pot and Encoder Controls
C31  22uF  [C0402]
C32  22uF  [C0402]
C33  22uF  [C0402]
C34  22uF  [C0402]
POT_1  10kΩ  [RES-TH_RK09K1130AAU]
POT_2  10kΩ  [RES-TH_RK09K1130AAU]
POT_3  10kΩ  [RES-TH_RK09K1130AAU]
POT_4  10kΩ  [RES-TH_RK09K1130AAU]
R14  100Ω  [R0603]
R15  100Ω  [R0603]
R16  100Ω  [R0603]
R17  100Ω  [R0603]
sheet Processing
C7  10uF  [C0603]
C8  100nF  [C0402]
C9  1uF  [C0201]
C10  100nF  [C0402]
C11  100nF  [C0402]
C12  10uF  [CASE-A_3216]
C13  22uF  [CASE-A_3216]
C44  10uF  [CASE-A_3216]
C45  100nF  [C0402]
C46  10nF  [C0603]
D1  SS34  [SMA_L4.3-W2.6-LS5.2-RD]
ESP32S3  ESP32-S3-WROOM-1-N16R8  [WIRELM-SMD_ESP32-S3-WROOM-1]
H_OLED  B-2100S04P-C000  [HDR-TH_4P-P2.54-V-M]
KEY_25  CPG151101S11-16  [SMD_KEYBOARD-SW]
KEY_SW_25  CPG1511F01S04  [KEY-TH_CPG1511F01S0X]  (no BOM)
L2  33Ω@100MHz 3A 22mΩ  [L0402]
LDO  AMS1117-3.3  [SOT-223-4_L6.5-W3.5-P2.30-LS7.0-BR]
OLED  HS96L03W2C03  [OLED-TH_L27.8-W27.2-P2.54_C9900033791]
POWER  LED-RED  [D-L1.6-W0.8-RD]
R1  5.1kΩ  [R0603]
R2  5.1kΩ  [R0603]
R3  10kΩ  [R0402]
R4  1kΩ  [R0603]
RESET  XKB5858-W-F-75  [SW-SMD_XKB5858-W-F-75]
USB  TYPEC-304YSSW-ACP16  [USB-SMD_TYPEC-304YSSW-ACP16]
sheet Touch control
C37  1uF  [C0201]
C38  100nF  [C0402]
C39  100nF  [C0402]
C40  1uF  [C0201]
C41  100nF  [C0402]
C43  2.2nF  [C0805]
TOUCH  CY8CMBR3108-LQXI  [QFN-16_L3.0-W3.0-P0.50-BL-EP1.7]
TP2  -  [matrix_touchpad]  (no BOM)
TP3  -  [matrix_touchpad]  (no BOM)
TP4  -  [matrix_touchpad]  (no BOM)
TP5  -  [matrix_touchpad]  (no BOM)
TPA1  -  [touchpad_external]  (no BOM)
TPA2  -  [touchpad_external]  (no BOM)
U5  -  [proximity_sensor]  (no BOM)
U6  -  [proximity_sensor]  (no BOM)

## Library data of the parts
3_3_BRIGDE A_D_BRIDGE = Res_0603: Supplier Footprint: 0603; Check: true
C12 C14 C44 = CA45-A010M106T: Capacitance: Tolerance:±20% Tolerance:±20% Rated Voltage: Equivalent Series Resistance(ESR):3Ω@100kHz Operating Temperature:-55℃~+125℃ Operating Temperature:-55℃~+125℃; LCSC Part Name: 10uF ±20% 10V; Supplier Part: C127946; Manufacturer: 湘怡中元/湘江; Supplier Footprint: CASE-A-3216; JLCPCB Part Class: Extended Part; Datasheet: https://atta.szlcsc.com/upload/public/pdf/source/20191009/C435293_78A410F3D73489DBEAC46056C4262F7A.pdf; Supplier: LCSC; Tolerance: ±20%; Equivalent Series Resistance(ESR): 3Ω@100kHz; Operating Temperature: -55℃~+125℃; Check: true
C13 C15 = CA45-A-10V-22uF-K: Capacitance: Tolerance:±10% Tolerance:±10% Rated Voltage: Equivalent Series Resistance(ESR):10Ω@100kHz Operating Temperature:-55℃~+125℃ Operating Temperature:-55℃~+125℃; LCSC Part Name: 22uF ±10% 10V; Supplier Part: C129272; Manufacturer: CEC(振华新云); Supplier Footprint: CASE-A-3216; JLCPCB Part Class: Extended Part; Datasheet: https://atta.szlcsc.com/upload/public/pdf/source/20170914/C129272_1505359928095968134.pdf; Supplier: LCSC; Tolerance: ±10%; Equivalent Series Resistance(ESR): 10Ω@100kHz; Operating Temperature: -55℃~+125℃; Check: true
C8 C10 C11 C16 C17 C20 C21 C29 C38 C39 C41 C45 CLED1-CLED31 CMIDI = CL05B104KO5NNNC: Capacitance: Tolerance:±10% Tolerance:±10% Voltage Rated: Temperature Coefficient:; LCSC Part Name: 100nF ±10% 16V; Supplier Part: C1525; Manufacturer: SAMSUNG(三星); Supplier Footprint: 0402; JLCPCB Part Class: Basic Part; Datasheet: https://atta.szlcsc.com/upload/public/pdf/source/20160218/1457707763339.pdf; Supplier: LCSC; Tolerance: ±10%; Check: true
C18 C19 C25-C28 C30 = CGA0402X5R225M6R3GT: Capacitance: Tolerance:±20% Tolerance:±20% Voltage Rated: Temperature Coefficient:; LCSC Part Name: 2.2uF ±20% 6.3V; Supplier Part: C7503516; Manufacturer: HRE(芯声); Supplier Footprint: 0402; JLCPCB Part Class: Extended Part; Supplier: LCSC; Tolerance: ±20%; Check: true
C22 = TCC0402X7R154K160AT: Capacitance:150nF Tolerance:±10% Tolerance:±10% Voltage Rated: Temperature Coefficient:; LCSC Part Name: 150nF ±10% 16V; Supplier Part: C7393865; Manufacturer: CCTC(三环); Supplier Footprint: 0402; JLCPCB Part Class: Extended Part; Datasheet: https://atta.szlcsc.com/upload/public/pdf/source/20230606/1C21CCC6A1C08E8C3D36DB4723A2CB7D.pdf; Supplier: LCSC; Tolerance: ±10%; Check: true
CN1-CN4 = PJ-3062-HD-B: Connector Type:3.5mm耳机座 Current Rating (Max):500mA Voltage Rating (Max):30V Operating Temperature Range:-20℃~+70℃ Operating Temperature Range:-20℃~+70℃ Soldering Temperature(Max):235℃; LCSC Part Name: 3.5mm耳机座 黑色; Supplier Part: C692443; Manufacturer: XKB Connectivity(中国星坤); Supplier Footprint: 插件; JLCPCB Part Class: Extended Part; Datasheet: https://atta.szlcsc.com/upload/public/pdf/source/20211011/B99FFD5F289995B7120B9F0E64D42649.pdf; Supplier: LCSC; Connector Type: 3.5mm耳机座; Current Rating (Max): 500mA; Voltage Rating (Max): 30V; Operating Temperature Range: -20℃~+70℃; Soldering Temperature(Max): 235℃; Check: false
CODEC = SGTL5000XNLA3R2: Type:Codec Interface:SPI；I2C；I2S Supply Voltage:- Supply Voltage:- Operating Temperature:-40℃~+85℃ Operating Temperature:-40℃~+85℃; LCSC Part Name: 低功耗立体声编解码器带耳机放大器 SGTL5000; Supplier Part: C2651833; Manufacturer: NXP(恩智浦); Supplier Footprint: QFN-20-EP(3x3); JLCPCB Part Class: Extended Part; Datasheet: https://www.nxp.com.cn/docs/en/data-sheet/SGTL5000.pdf; Supplier: LCSC; Type: Codec; Interface: SPI；I2C；I2S; Operating Temperature: -40℃~+85℃; Check: true
L1 = HCB2012KV-601T20: Impedance @ Frequency:600Ω Tolerance:±25% Tolerance:±25%; LCSC Part Name: 车载品-2mm*1.2mm-600?-±25%; Supplier Part: C5139902; Manufacturer: TAI-TECH(台庆); Supplier Footprint: 1.2x2mm; JLCPCB Part Class: Extended Part; Datasheet: https://atta.szlcsc.com/upload/public/pdf/source/20220826/DABADC95CDC6A536804A6AD1C60B0DD2.pdf; Supplier: LCSC; Impedance @ Frequency: 600Ω; Tolerance: ±25%; Check: true
MIC_INTERNAL = KEAG4544PF-K: Voltage - Supply:3V Voltage - Supply:3V Current - Supply:500uA Direction:Omni-directional Output Impedance:2.2kΩ S/N Ratio:60dB Sensitivity:-44dB@±3dB Diameter(φD):9.7mm Height:4.5mm Operating Temperature:-20℃~+70℃ Operating Temperature:-20℃~+70℃; LCSC Part Name: 全指向性麦克风,-44DB,3.0V; Supplier Part: C7430174; Manufacturer: KINGSTATE(志丰电子); Supplier Footprint: 插件,D=9.7mm; JLCPCB Part Class: Extended Part; Datasheet: https://atta.szlcsc.com/upload/public/pdf/source/20230721/F85D8F434902D33A6C9D6CB8E360EE1B.pdf; Supplier: LCSC; Voltage - Supply: 3V; Current - Supply: 500uA; Direction: Omni-directional; Output Impedance: 2.2kΩ; S/N Ratio: 60dB; Sensitivity: -44dB@±3dB; Diameter(φD): 9.7mm; Height: 4.5mm; Operating Temperature: -20℃~+70℃; Check: true
MIC_SELECT = XKB5858-Z-F-75: Self Lock / No Lock:LATCHING Actuator Style:Square Plunger Mounting Style:卧贴 Contact Current:100mA Voltage Rating (AC):250V Voltage Rating (DC):30V Insulation Resistance:100MΩ Actuator/Cap Color:White With Lamp:不带 Pin Style:Gull Wing Operating Force:250gf; Supplier Part: C2884736; Manufacturer: XKB Connectivity(中国星坤); Supplier Footprint: SMD; JLCPCB Part Class: Extended Part; Datasheet: https://atta.szlcsc.com/upload/public/pdf/source/20211009/95E080F85F5DEC82C83DDC4BCC34F336.pdf; Supplier: LCSC; Self Lock / No Lock: LATCHING; Actuator Style: Square Plunger; Mounting Style: 卧贴; Contact Current: 100mA; Voltage Rating (AC): 250V; Voltage Rating (DC): 30V; Insulation Resistance: 100MΩ; Actuator/Cap Color: White; With Lamp: 不带; Pin Style: Gull Wing; Operating Force: 250gf; Operating Temperature: -15℃~+55℃; Mechanical Life: 10万次; Check: true
R5 R6 R8 = 0603WAF2201T5E_C4190: Type:Thick Film Resistors Resistance:2.2kΩ Tolerance:±1% Tolerance:±1% Power(Watts): Overload Voltage (Max): Temperature Coefficient:±100ppm/℃ Temperature Coefficient:±100ppm/℃ Operating Temperature Range:-55℃~+155℃ Operating Temperature Range:-55℃~+155℃; LCSC Part Name: 2.2kΩ ±1% 100mW 厚膜电阻; Supplier Part: C4190; Manufacturer: UNI-ROYAL(厚声); Manufacturer Part: 0603WAF2201T5E; Supplier Footprint: 0603; JLCPCB Part Class: Basic Part; Datasheet: https://atta.szlcsc.com/upload/public/pdf/source/20200306/C422600_1E6D84923E4A46A82E41ADD87F860B5C.pdf; Supplier: LCSC; Type: Thick Film Resistors; Tolerance: ±1%; Temperature Coefficient: ±100ppm/℃; Operating Temperature Range: -55℃~+155℃; Check: true
R7 R14-R17 = RC0603FR-07100RL: Type:Thick Film Resistors Resistance: Tolerance:±1% Tolerance:±1% Power(Watts): Overload Voltage (Max): Temperature Coefficient:±100ppm/℃ Temperature Coefficient:±100ppm/℃ Operating Temperature Range:-55℃~+155℃ Operating Temperature Range:-55℃~+155℃; LCSC Part Name: 厚膜电阻 100Ω ±1% 100mW; Supplier Part: C105588; Manufacturer: YAGEO(国巨); Supplier Footprint: 0603; JLCPCB Part Class: Extended Part; Datasheet: https://atta.szlcsc.com/upload/public/pdf/source/20180316/70C0E2BDAE7FCC62C531A5A58D202EE1.pdf; Supplier: LCSC; Type: Thick Film Resistors; Tolerance: ±1%; Temperature Coefficient: ±100ppm/℃; Operating Temperature Range: -55℃~+155℃; Check: true
U1 = AMS1117-1.8_C347220: Output Type:Fixed Maximum Input Voltage:18V Output Voltage:1.8V Output Voltage:1.8V Output Current:1A Power Supply Rejection Ratio (PSRR):60dB@(120Hz) Dropout Voltage:1.3V@(1A) standby current:- Noise:- Feature:Overcurrent Protection(OCP) Operating Temper; LCSC Part Name: 输出:1.8V 电流:1A 耐压:12V; Supplier Part: C347220; Manufacturer: UMW(友台半导体); Supplier Footprint: SOT-223; JLCPCB Part Class: Extended Part; Datasheet: https://atta.szlcsc.com/upload/public/pdf/source/20241218/BAF0263FA2E44BCD8AF41AA4FA04EFAA.pdf; Supplier: LCSC; Output Type: Fixed; Maximum Input Voltage: 18V; Output Voltage: 1.8V; Output Current: 1A; Power Supply Rejection Ratio (PSRR): 60dB@(120Hz); Dropout Voltage: 1.3V@(1A); Feature: Overcurrent Protection(OCP); Output Polarity: Positive electrode; Number of Outputs: 1; Check: true
C9 C35-C37 C40 = GRM033R61A105ME44D: Capacitance: Tolerance:±20% Tolerance:±20% Voltage Rated: Temperature Coefficient:; LCSC Part Name: 1uF ±20% 10V; Supplier Part: C76935; Manufacturer: muRata(村田); Supplier Footprint: 0201; JLCPCB Part Class: Extended Part; Datasheet: https://atta.szlcsc.com/upload/public/pdf/source/20190904/C426118_85E81C7C1F21FC87C5FB6D536E0847B4.pdf; Supplier: LCSC; Tolerance: ±20%; Check: true
GYRO = STK8321: LCSC Part Name: 数字输出三轴MEMS加速度计; Supplier Part: C966924; Manufacturer: SENSORTEK(昇佳); Supplier Footprint: LGA-12(2x2); JLCPCB Part Class: Extended Part; Datasheet: https://item.szlcsc.com/datasheet/STK8321/1052901.html; Supplier: LCSC; Accelerometer Sensing Axis: X,Y,Z; Acceleration Measurement Range (MAX): ±8g; Sensor Type: Accelerometer; Output Bits: 12bit; Interface: I2C；SPI; Voltage - Supply: 1.7V~3.6V; Operating Temperature: -40℃~+85℃; Check: false
R18 = 0603WAF220JT5E: LCSC Part Name: 22Ω ±1% 100mW; Supplier Part: C23345; Manufacturer: UNI-ROYAL(厚声); Supplier Footprint: 0603; JLCPCB Part Class: Basic Part; Datasheet: https://atta.szlcsc.com/upload/public/pdf/source/20200306/C422600_1E6D84923E4A46A82E41ADD87F860B5C.pdf; Supplier: LCSC; Type: Thick Film Resistors; Tolerance: ±1%; Temperature Coefficient: ±100ppm/℃; Operating Temperature Range: -55℃~+155℃; Check: true
KEY_1-KEY_5 KEY_7-KEY_25 = CPG151101S11-16_C41430893: LCSC Part Name: 热插拔底座连接器 键盘配件; Supplier Part: C41430893; Manufacturer: HanElectricity(瀚源); Supplier Footprint: SMD,14.5x5.9mm; JLCPCB Part Class: Extended Part; Datasheet: https://item.szlcsc.com/datasheet/CPG151101S11-16/43288200.html; Supplier: LCSC; Check: true
KEY_6 = CPG151101S11-16_C41430893: LCSC Part Name: 热插拔底座连接器 键盘配件; Supplier Part: C41430893; Manufacturer: HanElectricity(瀚源); Supplier Footprint: SMD,14.5x5.9mm; JLCPCB Part Class: Extended Part; Datasheet: https://item.szlcsc.com/datasheet/CPG151101S11-16/43288200.html; Supplier: LCSC; Note: C; Check: true
KEY_D1-KEY_D24 = 1N4148WS: LCSC Part Name: 75V 150mA 4ns 弯脚（海鸥脚; Supplier Part: C181133; Manufacturer: Hottech(合科泰); Supplier Footprint: SOD-323; JLCPCB Part Class: Extended Part; Datasheet: https://atta.szlcsc.com/upload/public/pdf/source/20180131/C181133_15173932150211329261.pdf; Supplier: LCSC; Forward Voltage (Vf@If): 1.25V@150mA; Reverse Leakage Current: 1μA@75V; Operating Temperature: +150℃@(Tj); Check: true
KEY_SW_1-KEY_SW_25 = CPG1511F01S04: LCSC Part Name: BOX 红轴; Supplier Part: C400226; Manufacturer: Kailh(凯华); Supplier Footprint: 插件; JLCPCB Part Class: Extended Part; Datasheet: https://atta.szlcsc.com/upload/public/pdf/source/20190626/C400226_74917CF00C09065EB4010B1E948F36C3.pdf; Supplier: LCSC; Axis Type: Red axis; Operating Voltage: 2V~12V; Pin: 2; Mechanical Life: 80 million times; Operation Force: 45gf@±10gf; Conduction Travel: 1.8mm; Total Travel: 3.6mm; Operating Temperature: -10℃~+70℃; Check: true
LED1-LED31 = SK6812MINI-E_C5149201: Supplier Part: C5149201; Manufacturer: 欧思科光电; Supplier Footprint: SMD; JLCPCB Part Class: Extended Part; Datasheet: https://item.szlcsc.com/datasheet/SK6812MINI-E/5773397.html; Supplier: LCSC; Check: false
U2 = GT74LVC2T45V8: Input type:- output type:- Supply Voltage:- Supply Voltage:- Number of Elements:- Number of Bits per Element:- Channel Type:-; Supplier Part: C22356905; Manufacturer: GTIC(谷泰微); Supplier Footprint: VSSOP-8; JLCPCB Part Class: Extended Part; Datasheet: https://atta.szlcsc.com/upload/public/pdf/source/20240327/DE6958162A711F001014F8EB6D4E47C4.pdf; Supplier: LCSC; Check: true
D2 = 1N914W: Diode Configuration:Independent Type Forward Voltage (Vf@If):1V@10mA Reverse Voltage (Vr): Rectified Current: Reverse Leakage Current (Ir):5uA@75V Reverse Recovery Time (trr): Operating Temperature:- Operating Temperature:-; LCSC Part Name: T4(T4表示丝印); Supplier Part: C2836060; Manufacturer: CBI(创基); Supplier Footprint: SOD-123; JLCPCB Part Class: Extended Part; Datasheet: https://atta.szlcsc.com/upload/public/pdf/source/20210629/C2836060_26D61CEA786DE3B5B50DCDE2EFA33703.pdf; Supplier: LCSC; Diode Configuration: Independent Type; Forward Voltage (Vf@If): 1V@10mA; Reverse Leakage Current (Ir): 5uA@75V; Check: true
MIDI-IN MIDI-OUT = PJ-3062-HD-B: Connector Type:3.5mm耳机座 Current Rating (Max):500mA Voltage Rating (Max):30V Operating Temperature Range:-20℃~+70℃ Operating Temperature Range:-20℃~+70℃ Soldering Temperature(Max):235℃; LCSC Part Name: 3.5mm耳机座 黑色; Supplier Part: C692443; Manufacturer: XKB Connectivity(中国星坤); Supplier Footprint: 插件; JLCPCB Part Class: Extended Part; Datasheet: https://atta.szlcsc.com/upload/public/pdf/source/20211011/B99FFD5F289995B7120B9F0E64D42649.pdf; Supplier: LCSC; Connector Type: 3.5mm耳机座; Current Rating (Max): 500mA; Voltage Rating (Max): 30V; Operating Temperature Range: -20℃~+70℃; Soldering Temperature(Max): 235℃; Check: true
OPTOC = 6N137S1(TA): Input Type:DC Supply Voltage:- Supply Voltage:- Isolation Voltage(rms):5kV Common Mode Transient Immunity (CMTI):- Data Rate:10Mbit/s Propagation Delay tpLH/tpHL:75ns；75ns Number of Channels:1 Operating Temperature:-40℃~+85℃ Operating Temperature:-40℃~+85; LCSC Part Name: DC输入 1通道 隔离电压(rms):5000V; Supplier Part: C110020; Manufacturer: EVERLIGHT(亿光); Supplier Footprint: SOP-8-2.54mm; JLCPCB Part Class: Extended Part; Datasheet: https://atta.szlcsc.com/upload/public/pdf/source/20190828/C110020_4B0C201CC0F9D20CADA88B51D358A99F.pdf; Supplier: LCSC; Input Type: DC; Isolation Voltage(rms): 5kV; Data Rate: 10Mbit/s; Propagation Delay tpLH/tpHL: 75ns；75ns; Number of Channels: 1; Operating Temperature: -40℃~+85℃; Check: true
R9 = SCR0603J220R: Type:Thick Film Resistors Resistance: Tolerance:±5% Tolerance:±5% Power(Watts): Overload Voltage (Max): Operating Temperature Range:-55℃~+155℃ Operating Temperature Range:-55℃~+155℃; LCSC Part Name: 厚膜电阻 220Ω ±5% 100mW; Supplier Part: C3017752; Manufacturer: VO(翔胜); Supplier Footprint: 0603; JLCPCB Part Class: Extended Part; Datasheet: https://atta.szlcsc.com/upload/public/pdf/source/20220513/247AF9639BA21CF93567DC289CCC6A22.pdf; Supplier: LCSC; Type: Thick Film Resistors; Tolerance: ±5%; Operating Temperature Range: -55℃~+155℃; Check: true
R10 = SCR0603F470R: Type:Thick Film Resistors Resistance: Tolerance:±1% Tolerance:±1% Power(Watts): Overload Voltage (Max): Operating Temperature Range:-55℃~+155℃ Operating Temperature Range:-55℃~+155℃; LCSC Part Name: 厚膜电阻 470Ω ±1% 100mW; Supplier Part: C5140094; Manufacturer: VO(翔胜); Supplier Footprint: 0603; JLCPCB Part Class: Extended Part; Datasheet: https://atta.szlcsc.com/upload/public/pdf/source/20220823/E5DDB4243192CD3C8AE9677163F934FF.pdf; Supplier: LCSC; Type: Thick Film Resistors; Tolerance: ±1%; Operating Temperature Range: -55℃~+155℃; Check: true
R12 = 0603WAF330JT5E: Type:Thick Film Resistors Resistance:33Ω Tolerance:±1% Tolerance:±1% Power(Watts): Overload Voltage (Max): Temperature Coefficient:±100ppm/℃ Temperature Coefficient:±100ppm/℃ Operating Temperature Range:-55℃~+155℃ Operating Temperature Range:-55℃~+155℃; LCSC Part Name: 33Ω ±1% 100mW 厚膜电阻; Supplier Part: C23140; Manufacturer: UNI-ROYAL(厚声); Supplier Footprint: 0603; JLCPCB Part Class: Basic Part; Datasheet: https://atta.szlcsc.com/upload/public/pdf/source/20200306/C422600_1E6D84923E4A46A82E41ADD87F860B5C.pdf; Supplier: LCSC; Type: Thick Film Resistors; Tolerance: ±1%; Temperature Coefficient: ±100ppm/℃; Operating Temperature Range: -55℃~+155℃; Check: true
R13 = QR0603J10R0P05Z: Type:Thick Film Resistors Resistance: Tolerance:±5% Tolerance:±5% Power(Watts): Overload Voltage (Max): Temperature Coefficient:±100ppm/℃ Temperature Coefficient:±100ppm/℃ Operating Temperature Range:-55℃~+155℃ Operating Temperature Range:-55℃~+155℃; LCSC Part Name: 厚膜电阻 10Ω ±5% 100mW; Supplier Part: C176153; Manufacturer: EVER OHMS(天二科技); Supplier Footprint: 0603; JLCPCB Part Class: Extended Part; Datasheet: https://atta.szlcsc.com/upload/public/pdf/source/20190816/C191725_FB5BDDD87CE7DE7F0F741FE894220CBC.pdf; Supplier: LCSC; Type: Thick Film Resistors; Tolerance: ±5%; Temperature Coefficient: ±100ppm/℃; Operating Temperature Range: -55℃~+155℃; Check: true
C31-C34 = CGA0402X5R226M100GT: Capacitance:22uF Tolerance:±20% Tolerance:±20% Voltage Rated: Temperature Coefficient:; LCSC Part Name: 22uF ±20% 10V; Supplier Part: C6119813; Manufacturer: HRE(芯声); Supplier Footprint: 0402; JLCPCB Part Class: Extended Part; Supplier: LCSC; Tolerance: ±20%; Check: true
POT_1-POT_4 = RK09K1130A5R: Resistance: Tolerance:±20% Tolerance:±20%; LCSC Part Name: 10kΩ ±20%; Supplier Part: C209779; Manufacturer: ALPSALPINE(阿尔卑斯阿尔派); Supplier Footprint: 插件; JLCPCB Part Class: Extended Part; Datasheet: https://atta.szlcsc.com/upload/public/pdf/source/20180404/C209779_144B5EF41D1B8507FF4660D0445AF581.pdf; Supplier: LCSC; Tolerance: ±20%; Check: true
C7 = CGA0603X5R106K100JT: Capacitance:10000000pF Tolerance:±10% Tolerance:±10% Voltage Rated: Temperature Coefficient:; LCSC Part Name: 10uF ±10% 10V; Supplier Part: C6119842; Manufacturer: HRE(芯声); Supplier Footprint: 0603; JLCPCB Part Class: Extended Part; Supplier: LCSC; Tolerance: ±10%; Check: true
C46 = CAP_0603: Supplier Footprint: 0603
D1 = SS34_C8678: Diode Configuration:Independent Type Forward Voltage (Vf@If):550mV@3A Reverse Voltage (Vr):40V Rectified Current:3A Reverse Leakage Current (Ir):500uA@40V; LCSC Part Name: 电压:40V 电流:3A; Supplier Part: C8678; Manufacturer: MDD(辰达半导体); Supplier Footprint: SMA(DO-214AC); JLCPCB Part Class: Basic Part; Datasheet: https://atta.szlcsc.com/upload/public/pdf/source/20240710/2118BB86FDDB2E0B294389AC1F3F65C8.pdf; Supplier: LCSC; Diode Configuration: Independent Type; Forward Voltage (Vf@If): 550mV@3A; Reverse Voltage (Vr): 40V; Rectified Current: 3A; Reverse Leakage Current (Ir): 500uA@40V; Check: true
ESP32S3 = ESP32-S3-WROOM-1-N16R8: Supplier: LCSC; Supplier Part: C2913202; Manufacturer: ESPRESSIF(乐鑫); JLCPCB Part Class: Extended Part; LCSC Part Name: 通用型Wi-Fi+低功耗蓝牙MCU模组; Supplier Footprint: SMD,18x25.5mm; Datasheet: https://atta.szlcsc.com/upload/public/pdf/source/20220705/4E799F39581577F766659887F738A439.pdf; Check: true
H_OLED = B-2100S04P-C000: Pin Structure:1x4P Pitch:2.54mm Row Spacing:- Circluar Pins/Square Pins:Square Pins Mounting Type:Straight Number of Rows:Plugin Number of Pins:4P Current Rating (Max):3A Voltage Rating (Max):- Length of Mating Pin:3.6mm Insulation Height:5mm Length of En; LCSC Part Name: 间距:2.54mm 1x4P 直插 方针; Supplier Part: C2902691; Manufacturer: Ckmtw(灿科盟); Supplier Footprint: 插件,P=2.54mm; JLCPCB Part Class: Extended Part; Datasheet: https://atta.szlcsc.com/upload/public/pdf/source/20211021/3357FA133737681A7A46A5BDD4998D56.pdf; Supplier: LCSC; Pin Structure: 1x4P; Pitch: 2.54mm; Circluar Pins/Square Pins: Square Pins; Mounting Type: Straight; Number of Rows: Plugin; Number of Pins: 4P; Current Rating (Max): 3A; Length of Mating Pin: 3.6mm; Insulation Height: 5mm; Length of End Connection Pin: 3mm; Operating Temperature Range: -40℃~+105℃; Color: Black; Check: true
L2 = L_0603: Supplier Footprint: L0603; Supplier Part: C160974
LDO = AMS1117-3.3_C347222: Output Type:Fixed Maximum Input Voltage:12V Output Voltage:3.3V Output Voltage:3.3V Output Current:1A Power Supply Rejection Ratio (PSRR):60dB@(120Hz) Dropout Voltage:1.3V@(1A) standby current:- Noise:- Feature:Overcurrent Protection(OCP) Operating Temper; LCSC Part Name: 输出:3.3V 电流:1A 耐压:12V; Supplier Part: C347222; Manufacturer: UMW(友台半导体); Supplier Footprint: SOT-223; JLCPCB Part Class: Extended Part; Datasheet: https://atta.szlcsc.com/upload/public/pdf/source/20241218/BAF0263FA2E44BCD8AF41AA4FA04EFAA.pdf; Supplier: LCSC; Output Type: Fixed; Maximum Input Voltage: 12V; Output Voltage: 3.3V; Output Current: 1A; Power Supply Rejection Ratio (PSRR): 60dB@(120Hz); Dropout Voltage: 1.3V@(1A); Feature: Overcurrent Protection(OCP); Output Polarity: Positive electrode; Number of Outputs: 1; Check: true
OLED = HS96L03W2C03: Main Control Chip:SSD1315 Interface Type:I2C Size:0.96 Pixel Resolution:128x64 Operating Temperature:-40℃~+70℃ Operating Temperature:-40℃~+70℃; LCSC Part Name: 0.96寸OLED显示屏窄白光IIC; Supplier Part: C5248080; Manufacturer: HS(汉昇); JLCPCB Part Class: Extended Part; Datasheet: https://atta.szlcsc.com/upload/public/pdf/source/20230627/763D01F79A90007632F098068C7C8AD9.pdf; Supplier: LCSC; Main Control Chip: SSD1315; Interface Type: I2C; Size: 0.96; Pixel Resolution: 128x64; Operating Temperature: -40℃~+70℃; Check: true
POWER = F.0603.00025/P2-0603G1TS2-06T-002: Emitted Color:Emerald Forward Voltage (VF):2.6V~2.9V Forward Voltage (VF):2.6V~2.9V Forward Current:- Dominant Wavelength:520nm~525nm Dominant Wavelength:520nm~525nm Lens Color:- Luminous Intensity:230mcd Luminous Intensity:230mcd Viewing Angle:120° Opera; Supplier Part: C7496818; Manufacturer: TUOZHAN(拓展光电); Supplier Footprint: 0603; JLCPCB Part Class: Extended Part; Datasheet: https://atta.szlcsc.com/upload/public/pdf/source/20230809/EA2F9723ADA317BF34481AEADE85B597.pdf; Supplier: LCSC; Emitted Color: Emerald; Forward Voltage (VF): 2.6V~2.9V; Dominant Wavelength: 520nm~525nm; Luminous Intensity: 230mcd; Viewing Angle: 120°; Operating Temperature: -40℃~+85℃; Check: true
R1 R2 = 0603WAF5101T5E: Type:Thick Film Resistors Resistance:5.1kΩ Tolerance:±1% Tolerance:±1% Power(Watts): Overload Voltage (Max): Temperature Coefficient:±100ppm/℃ Temperature Coefficient:±100ppm/℃ Operating Temperature Range:-55℃~+155℃ Operating Temperature Range:-55℃~+155℃; LCSC Part Name: 5.1kΩ ±1% 100mW 厚膜电阻; Supplier Part: C23186; Manufacturer: UNI-ROYAL(厚声); Supplier Footprint: 0603; JLCPCB Part Class: Basic Part; Datasheet: https://atta.szlcsc.com/upload/public/pdf/source/20200306/C422600_1E6D84923E4A46A82E41ADD87F860B5C.pdf; Supplier: LCSC; Type: Thick Film Resistors; Tolerance: ±1%; Temperature Coefficient: ±100ppm/℃; Operating Temperature Range: -55℃~+155℃; Check: true
R3 = SCR0402J10K: Type:Thick Film Resistors Resistance: Tolerance:±5% Tolerance:±5% Power(Watts): Overload Voltage (Max): Operating Temperature Range:-55℃~+155℃ Operating Temperature Range:-55℃~+155℃; LCSC Part Name: 厚膜电阻 10kΩ ±5% 62.5mW; Supplier Part: C3017497; Manufacturer: VO(翔胜); Supplier Footprint: 0402; JLCPCB Part Class: Extended Part; Datasheet: https://atta.szlcsc.com/upload/public/pdf/source/20220513/247AF9639BA21CF93567DC289CCC6A22.pdf; Supplier: LCSC; Type: Thick Film Resistors; Tolerance: ±5%; Operating Temperature Range: -55℃~+155℃; Check: true
R4 = FRC0603J102 TS: Type:Thick Film Resistors Resistance:1kΩ Tolerance:±5% Tolerance:±5% Power(Watts): Overload Voltage (Max): Temperature Coefficient:±100ppm/℃ Temperature Coefficient:±100ppm/℃ Operating Temperature Range:-55℃~+155℃ Operating Temperature Range:-55℃~+155℃; LCSC Part Name: 1kΩ ±5% 100mW 厚膜电阻; Supplier Part: C2907113; Manufacturer: FOJAN(富捷); Supplier Footprint: 0603; JLCPCB Part Class: Extended Part; Datasheet: https://atta.szlcsc.com/upload/public/pdf/source/20211221/925EC7D7225764EE0046F22065062C87.pdf; Supplier: LCSC; Type: Thick Film Resistors; Tolerance: ±5%; Temperature Coefficient: ±100ppm/℃; Operating Temperature Range: -55℃~+155℃; Check: true
RESET = XKB5858-W-F-75: Self Lock / No Lock:No lock Actuator Style:Square Plunger Mounting Style:Horizontal attachment Contact Current:100mA Voltage Rating (AC):250V Voltage Rating (DC):30V Insulation Resistance:100MΩ Actuator/Cap Color:White With Lamp:Without Pin Style:Gullwing; Supplier Part: C780037; Manufacturer: XKB Connection(中国星坤); Supplier Footprint: SMD; JLCPCB Part Class: Extended Part; Datasheet: https://atta.szlcsc.com/upload/public/pdf/source/20211009/95E080F85F5DEC82C83DDC4BCC34F336.pdf; Supplier: LCSC; Self Lock / No Lock: No lock; Actuator Style: Square Plunger; Mounting Style: Horizontal attachment; Contact Current: 100mA; Voltage Rating (AC): 250V; Voltage Rating (DC): 30V; Insulation Resistance: 100MΩ; Actuator/Cap Color: White; With Lamp: Without; Pin Style: Gullwing; Operating Force: 250gf; Operating Temperature: -15℃~+55℃; Mechanical Life: 100000 Times; Check: true
USB = TYPEC-304YSSW-ACP16: Connector Type:Type-C Standard:USB 3.1 Gender:Female Number of Ports:1 Number of Contacts:16P Mounting Style:卧贴 Current Rating - Power (Max):5A Contact Material:- Contact Plating:- Operating Temperature Range:-25℃~+85℃ Operating Temperature Range:-25℃~+85; LCSC Part Name: Type-C 母 卧贴; Supplier Part: C2840392; Manufacturer: XUNPU(讯普); Supplier Footprint: SMD; JLCPCB Part Class: Extended Part; Datasheet: https://atta.szlcsc.com/upload/public/pdf/source/20210615/C2840392_E4D6700BD82FA37F52F4054C59437243.pdf; Supplier: LCSC; Connector Type: Type-C; Standard: USB 3.1; Gender: Female; Number of Ports: 1; Number of Contacts: 16P; Mounting Style: 卧贴; Current Rating - Power (Max): 5A; Operating Temperature Range: -25℃~+85℃; Soldering Temperature(Max): 260℃; Check: true
C43 = CL21C222JBFNNNE: LCSC Part Name: 2.2nF(222) ±5% 50V; Supplier Part: C28260; Manufacturer: SAMSUNG(三星); Supplier Footprint: 0805; JLCPCB Part Class: Basic Part; Datasheet: https://atta.szlcsc.com/upload/public/pdf/source/20160103/1457707717122.pdf; Supplier: LCSC; Check: true
TOUCH = CY8CMBR3108-LQXI: LCSC Part Name: Capacitive Touch Buttons; Supplier Part: C511139; Manufacturer: Infineon/CYPRESS(赛普拉斯); Supplier Footprint: QFN-16-EP(3x3); JLCPCB Part Class: Extended Part; Datasheet: https://item.szlcsc.com/datasheet/CY8CMBR3108-LQXI/525970.html; Supplier: LCSC; Number of Channels: 8; Chip Function: Capacitive Touch; Voltage - Supply: 1.71V~5.5V; Operating Temperature: -40℃~+85℃; Check: true
TP2-TP5 = matrix_touchpad: Check: true
TPA1 TPA2 = attached_touchpad: Check: true
U5 U6 = proximiy_pad: Check: true

## Nets
+1.8V: C15.1 CODEC.20(VDDD) U1.2(VOUT(TAB)) U1.4(TAB)
+3.3V: 3_3_BRIGDE.1 3_3_BRIGDE.2 C7.1 C8.2 C13.1 C14.1 C16.2 C19.2 C20.2 C21.2 C36.1 C37.1 C38.2 C39.2 C40.1 CMIDI.2 CODEC.12(VDDIO) ESP32S3.2(3V3) GYRO.3(VDDIO) GYRO.10(/CS) H_OLED.2 L1.1 LDO.2(VOUT(TAB)) LDO.4(TAB) OLED.2(VCC) OPTOC.8(VCC) R3.1 R4.1 R5.1 R6.1 R10.2 R12.2 R14.2 R15.2 R16.2 R17.2 R18.2 TOUCH.5(VDDIO) TOUCH.6(VDD) U1.3(VIN) U2.1(VCCA) U2.5(DIR)
+5V: C12.1 C44.1 C45.2 CLED1.2 CLED2.2 CLED3.2 CLED4.2 CLED5.2 CLED6.2 CLED7.2 CLED8.2 CLED9.2 CLED10.2 CLED11.2 CLED12.2 CLED13.2 CLED14.2 CLED15.2 CLED16.2 CLED17.2 CLED18.2 CLED19.2 CLED20.2 CLED21.2 CLED22.2 CLED23.2 CLED24.2 CLED25.2 CLED26.2 CLED27.2 CLED28.2 CLED29.2 CLED30.2 CLED31.2 L2.2 LDO.3(VIN) LED1.1(VDD) LED2.1(VDD) LED3.1(VDD) LED4.1(VDD) LED5.1(VDD) LED6.1(VDD) LED7.1(VDD) LED8.1(VDD) LED9.1(VDD) LED10.1(VDD) LED11.1(VDD) LED12.1(VDD) LED13.1(VDD) LED14.1(VDD) LED15.1(VDD) LED16.1(VDD) LED17.1(VDD) LED18.1(VDD) LED19.1(VDD) LED20.1(VDD) LED21.1(VDD) LED22.1(VDD) LED23.1(VDD) LED24.1(VDD) LED25.1(VDD) LED26.1(VDD) LED27.1(VDD) LED28.1(VDD) LED29.1(VDD) LED30.1(VDD) LED31.1(VDD) U2.8(VCCB)
AGND: A_D_BRIDGE.1 A_D_BRIDGE.2 C7.2 C8.1 C9.2 C10.1 C11.1 C12.2 C13.2 C14.2 C15.2 C16.1 C17.1 C18.1 C19.1 C20.1 C21.1 C22.1 C30.1 C31.1 C32.1 C33.1 C34.1 C35.2 C36.2 C37.2 C38.1 C39.1 C40.2 C41.2 C43.2 C44.2 C45.1 C46.1 CLED1.1 CLED2.1 CLED3.1 CLED4.1 CLED5.1 CLED6.1 CLED7.1 CLED8.1 CLED9.1 CLED10.1 CLED11.1 CLED12.1 CLED13.1 CLED14.1 CLED15.1 CLED16.1 CLED17.1 CLED18.1 CLED19.1 CLED20.1 CLED21.1 CLED22.1 CLED23.1 CLED24.1 CLED25.1 CLED26.1 CLED27.1 CLED28.1 CLED29.1 CLED30.1 CLED31.1 CMIDI.1 CN1.1 CN2.1 CN4.1 CODEC.21(EP) ESP32S3.1(GND) ESP32S3.40(GND) ESP32S3.41(GND) GYRO.1(SA0/SDO) GYRO.4(Reserved) GYRO.8(GNDIO) GYRO.9(GND) H_OLED.1 KEY_25.2 LDO.1(ADJ(GND)) LED1.3(GND) LED2.3(GND) LED3.3(GND) LED4.3(GND) LED5.3(GND) LED6.3(GND) LED7.3(GND) LED8.3(GND) LED9.3(GND) LED10.3(GND) LED11.3(GND) LED12.3(GND) LED13.3(GND) LED14.3(GND) LED15.3(GND) LED16.3(GND) LED17.3(GND) LED18.3(GND) LED19.3(GND) LED20.3(GND) LED21.3(GND) LED22.3(GND) LED23.3(GND) LED24.3(GND) LED25.3(GND) LED26.3(GND) LED27.3(GND) LED28.3(GND) LED29.3(GND) LED30.3(GND) LED31.3(GND) MIC_INTERNAL.2 MIDI-OUT.1 OLED.1(GND) OPTOC.5(GND) POT_1.1 POT_1.4(EH) POT_1.5(EH) POT_2.1 POT_2.4(EH) POT_2.5(EH) POT_3.1 POT_3.4(EH) POT_3.5(EH) POT_4.1 POT_4.4(EH) POT_4.5(EH) POWER.1(K) R1.1 R2.1 RESET.1 RESET.2 RESET.5 TOUCH.7(VSS) TOUCH.17(EP) U1.1(ADJ(GND)) U2.3(A2) U2.4(GND) U2.6(B2) USB.13(GND) USB.14(GND) USB.15(GND) USB.16(GND) USB.A1B12(GND) USB.B1A12(GND)
VBUS: D1.2(A) USB.A4B9(VBUS) USB.B4A9(VBUS)
CHIP_BOOT: C10.2 ESP32S3.27(IO0) KEY_25.1
CHIP_RESET: C9.1 C11.2 ESP32S3.3(EN) R3.2 RESET.4 RESET.6
HEADPHONE_GROUND: CN3.1 CODEC.2(HP_VGND)
HEADPHONE_LEFT: CN3.5 CODEC.4(HP_L)
HEADPHONE_RIGHT: CN3.2 CODEC.1(HP_R)
I2C_SCL: CODEC.19(CTRL_CLK) ESP32S3.25(IO48) GYRO.12(SCL/SCK) H_OLED.3 OLED.3(SCL) R5.2 TOUCH.15(I2C SCL)
I2C_SDA: CODEC.18(CTRL_DATA) ESP32S3.24(IO47) GYRO.2(SDA/SDI/SDIO) H_OLED.4 OLED.4(SDA) R6.2 TOUCH.14(I2C SDA)
I2S_BCLK: CODEC.15(I2S_SCLK) ESP32S3.33(IO40)
I2S_DIN: CODEC.17(I2S_DIN) ESP32S3.31(IO38)
I2S_DOUT: CODEC.16(I2S_DOUT) ESP32S3.32(IO39)
I2S_MLCK: ESP32S3.35(IO42) R7.1
I2S_WS: CODEC.14(I2S_LRCLK) ESP32S3.34(IO41)
LED_CTRL: ESP32S3.23(IO21) U2.2(A1)
LINE_IN_LEFT: C25.1 CN1.5
LINE_IN_RIGHT: C26.1 CN1.2
LINE_OUT_LEFT: C27.1 CN2.5
LINE_OUT_RIGHT: C28.1 CN2.2
MIC_EXTERNAL: CN4.5 MIC_SELECT.4 MIC_SELECT.6
MIC_IN: C29.1 MIC_SELECT.1 MIC_SELECT.2 MIC_SELECT.5 R8.1
MIC_INTERNAL: MIC_INTERNAL.1 MIC_SELECT.3
MIDI_IN: ESP32S3.11(IO18) OPTOC.6(VOUT) R10.1
MIDI_OUT: ESP32S3.10(IO17) R13.2
POT_1: ESP32S3.15(IO3) POT_1.2
POT_2: ESP32S3.9(IO16) POT_2.2
POT_3: ESP32S3.39(IO1) POT_3.2
POT_4: ESP32S3.38(IO2) POT_4.2
TOUCH_COL_1: ESP32S3.22(IO14) KEY_D1.1(C) KEY_D6.1(C) KEY_D11.1(C) KEY_D16.1(C) KEY_D21.1(C)
TOUCH_COL_2: ESP32S3.21(IO13) KEY_D2.1(C) KEY_D7.1(C) KEY_D12.1(C) KEY_D17.1(C) KEY_D22.1(C)
TOUCH_COL_3: ESP32S3.20(IO12) KEY_D3.1(C) KEY_D8.1(C) KEY_D13.1(C) KEY_D18.1(C) KEY_D23.1(C)
TOUCH_COL_4: ESP32S3.19(IO11) KEY_D4.1(C) KEY_D9.1(C) KEY_D14.1(C) KEY_D19.1(C) KEY_D24.1(C)
TOUCH_COL_5: ESP32S3.18(IO10) KEY_D5.1(C) KEY_D10.1(C) KEY_D15.1(C) KEY_D20.1(C)
TOUCH_ROW_1: ESP32S3.4(IO4) KEY_1.1 KEY_2.1 KEY_3.1 KEY_4.1 KEY_5.1
TOUCH_ROW_2: ESP32S3.5(IO5) KEY_6.1 KEY_7.1 KEY_8.1 KEY_9.1 KEY_10.1
TOUCH_ROW_3: ESP32S3.6(IO6) KEY_11.1 KEY_12.1 KEY_13.1 KEY_14.1 KEY_15.1
TOUCH_ROW_4: ESP32S3.7(IO7) KEY_16.1 KEY_17.1 KEY_18.1 KEY_19.1 KEY_20.1
TOUCH_ROW_5: ESP32S3.8(IO15) KEY_21.1 KEY_22.1 KEY_23.1 KEY_24.1
USB_D+: ESP32S3.14(IO20) USB.A6(DP1) USB.B6(DP2)
USB_D-: ESP32S3.13(IO19) USB.A7(DN1) USB.B7(DN2)
$1N3148: POWER.2(A) R4.2
$1N55832: R2.2 USB.A5(CC1)
$1N58797: R1.2 USB.B5(CC2)
$1N86646: C46.2 D1.1(K) L2.1
$2N6260: CODEC.13(SYS_MCLK) R7.2
$2N10513: C17.2 C18.2 CODEC.3(VDDA) L1.2
$2N11857: C22.2 CODEC.5(VAG)
$2N12488: C28.2 CODEC.6(LINEOUT_R)
$2N12493: C27.2 CODEC.7(LINEOUT_L)
$2N12499: C26.2 CODEC.8(LINEIN_R)
$2N12505: C25.2 CODEC.9(LINEIN_L)
$2N12879: C29.2 CODEC.10(MIC)
$2N12925: C30.2 CODEC.11(MIC_BIAS) R8.2
$3N7352: LED13.2(DOUT) LED14.4(DIN)
$3N7353: LED12.2(DOUT) LED13.4(DIN)
$3N7358: LED10.2(DOUT) LED11.4(DIN)
$3N7360: LED11.2(DOUT) LED12.4(DIN)
$3N7363: LED9.2(DOUT) LED10.4(DIN)
$3N29106: LED1.2(DOUT) LED2.4(DIN)
$3N29228: LED2.2(DOUT) LED3.4(DIN)
$3N29289: LED3.2(DOUT) LED4.4(DIN)
$3N29354: LED4.2(DOUT) LED5.4(DIN)
$3N29806: LED5.2(DOUT) LED6.4(DIN)
$3N29830: LED7.2(DOUT) LED8.4(DIN)
$3N29848: LED6.2(DOUT) LED7.4(DIN)
$3N29909: LED8.2(DOUT) LED9.4(DIN)
$3N29919: LED14.2(DOUT) LED15.4(DIN)
$3N30618: LED16.2(DOUT) LED17.4(DIN)
$3N30621: LED17.2(DOUT) LED18.4(DIN)
$3N30624: LED18.2(DOUT) LED19.4(DIN)
$3N30627: LED19.2(DOUT) LED20.4(DIN)
$3N30629: LED20.2(DOUT) LED21.4(DIN)
$3N30636: LED15.2(DOUT) LED16.4(DIN)
$3N30640: LED21.2(DOUT) LED22.4(DIN)
$3N31670: LED23.2(DOUT) LED24.4(DIN)
$3N31676: LED22.2(DOUT) LED23.4(DIN)
$3N32041: LED24.2(DOUT) LED25.4(DIN)
$3N32047: LED26.2(DOUT) LED27.4(DIN)
$3N32052: LED25.2(DOUT) LED26.4(DIN)
$3N32273: LED28.2(DOUT) LED29.4(DIN)
$3N32275: LED27.2(DOUT) LED28.4(DIN)
$4N9201: KEY_1.2 KEY_D1.2(A)
$4N9426: KEY_2.2 KEY_D2.2(A)
$4N9511: KEY_3.2 KEY_D3.2(A)
$4N9594: KEY_4.2 KEY_D4.2(A)
$4N9679: KEY_5.2 KEY_D5.2(A)
$4N10056: KEY_6.2 KEY_D6.2(A)
$4N10060: KEY_7.2 KEY_D7.2(A)
$4N10064: KEY_8.2 KEY_D8.2(A)
$4N10068: KEY_9.2 KEY_D9.2(A)
$4N10072: KEY_10.2 KEY_D10.2(A)
$4N10438: KEY_11.2 KEY_D11.2(A)
$4N10442: KEY_12.2 KEY_D12.2(A)
$4N10446: KEY_13.2 KEY_D13.2(A)
$4N10450: KEY_14.2 KEY_D14.2(A)
$4N10454: KEY_15.2 KEY_D15.2(A)
$4N10820: KEY_16.2 KEY_D16.2(A)
$4N10824: KEY_17.2 KEY_D17.2(A)
$4N10828: KEY_18.2 KEY_D18.2(A)
$4N10832: KEY_19.2 KEY_D19.2(A)
$4N10836: KEY_20.2 KEY_D20.2(A)
$4N11204: KEY_24.2 KEY_D24.2(A)
$4N11212: KEY_23.2 KEY_D23.2(A)
$4N11214: KEY_22.2 KEY_D22.2(A)
$4N11220: KEY_21.2 KEY_D21.2(A)
$5N1901: C31.2 POT_4.3 R14.1
$5N2026: C32.2 POT_3.3 R15.1
$5N2131: C33.2 POT_2.3 R16.1
$5N2225: C34.2 POT_1.3 R17.1
$6N2073: D2.1(K) OPTOC.2(AN) R9.2
$6N2078: D2.2(A) MIDI-IN.5 OPTOC.3(CAT)
$6N2276: MIDI-IN.2 R9.1
$6N18274: MIDI-OUT.5 R13.1
$6N18276: MIDI-OUT.2 R12.1
$7N865: TOUCH.12(CS2/GUARD) TP2.1
$7N869: TOUCH.13(CS3) TP3.1
$7N944: TOUCH.11(CS7/GPO3/SH) TP5.1
$7N948: TOUCH.10(CS6/GPO2) TP4.1
$7N952: TOUCH.9(CS5/GPO1) TPA2.1
$7N954: TOUCH.8(CS4/GPO0) TPA1.1
$7N1428: C41.1 TOUCH.4(VCC)
$7N1754: C43.1 TOUCH.3(CMOD)
$8N693: C35.1 GYRO.7(VS) R18.1
Net-(LED1-4): LED1.4(DIN) LED31.2(DOUT)
Net-(LED30-2): LED30.2(DOUT) LED31.4(DIN)
Net-(LED30-4): LED30.4(DIN) U2.7(B1)
Net-(TOUCH-1): TOUCH.1(CS0/PS0) U5.1
Net-(TOUCH-2): TOUCH.2(CS1/PS1) U6.1

Not connected (* = marked no-connect by the designer): CN1 3 4; CN2 3 4; CN3 3 4; CN4 2 3 4; ESP32S3 12(IO8)* 16(IO46)* 17(IO9)* 26(IO45)* 28(IO35)* 29(IO36)* 30(IO37)* 36(RXD0)* 37(TXD0)*; GYRO 5(INT1) 6(INT2) 11(NC); KEY_SW_1 1 2; KEY_SW_2 1 2; KEY_SW_3 1 2; KEY_SW_4 1 2; KEY_SW_5 1 2; KEY_SW_6 1 2; KEY_SW_7 1 2; KEY_SW_8 1 2; KEY_SW_9 1 2; KEY_SW_10 1 2; KEY_SW_11 1 2; KEY_SW_12 1 2; KEY_SW_13 1 2; KEY_SW_14 1 2; KEY_SW_15 1 2; KEY_SW_16 1 2; KEY_SW_17 1 2; KEY_SW_18 1 2; KEY_SW_19 1 2; KEY_SW_20 1 2; KEY_SW_21 1 2; KEY_SW_22 1 2; KEY_SW_23 1 2; KEY_SW_24 1 2; KEY_SW_25 1 2; LED29 2(DOUT); MIDI-IN 1* 3* 4*; MIDI-OUT 3* 4*; OPTOC 1(NC)* 4(NC)* 7(VE); RESET 3*; TOUCH 16(HI#/BUZ)*; USB A8(SBU1) B8(SBU2)

## Notes on the sheets
sheet 1
- Address = 0x3C
sheet 6
- MIDI TRS-A
  C = TIP - Current Sink (data)
  B = RING  - Current Source (vcc)
  A = SLEEVE  - Shield (gnd)
- MIDI TRS-A
  C = TIP - Current Sink (data)
  B = RING  - Current Source (vcc)
  A = SLEEVE  - Shield (gnd)
sheet 7
- Address = 0x37
sheet 8
- Address = 0x0F
